# Altium project Softcore_SA_HW.PrjPcb
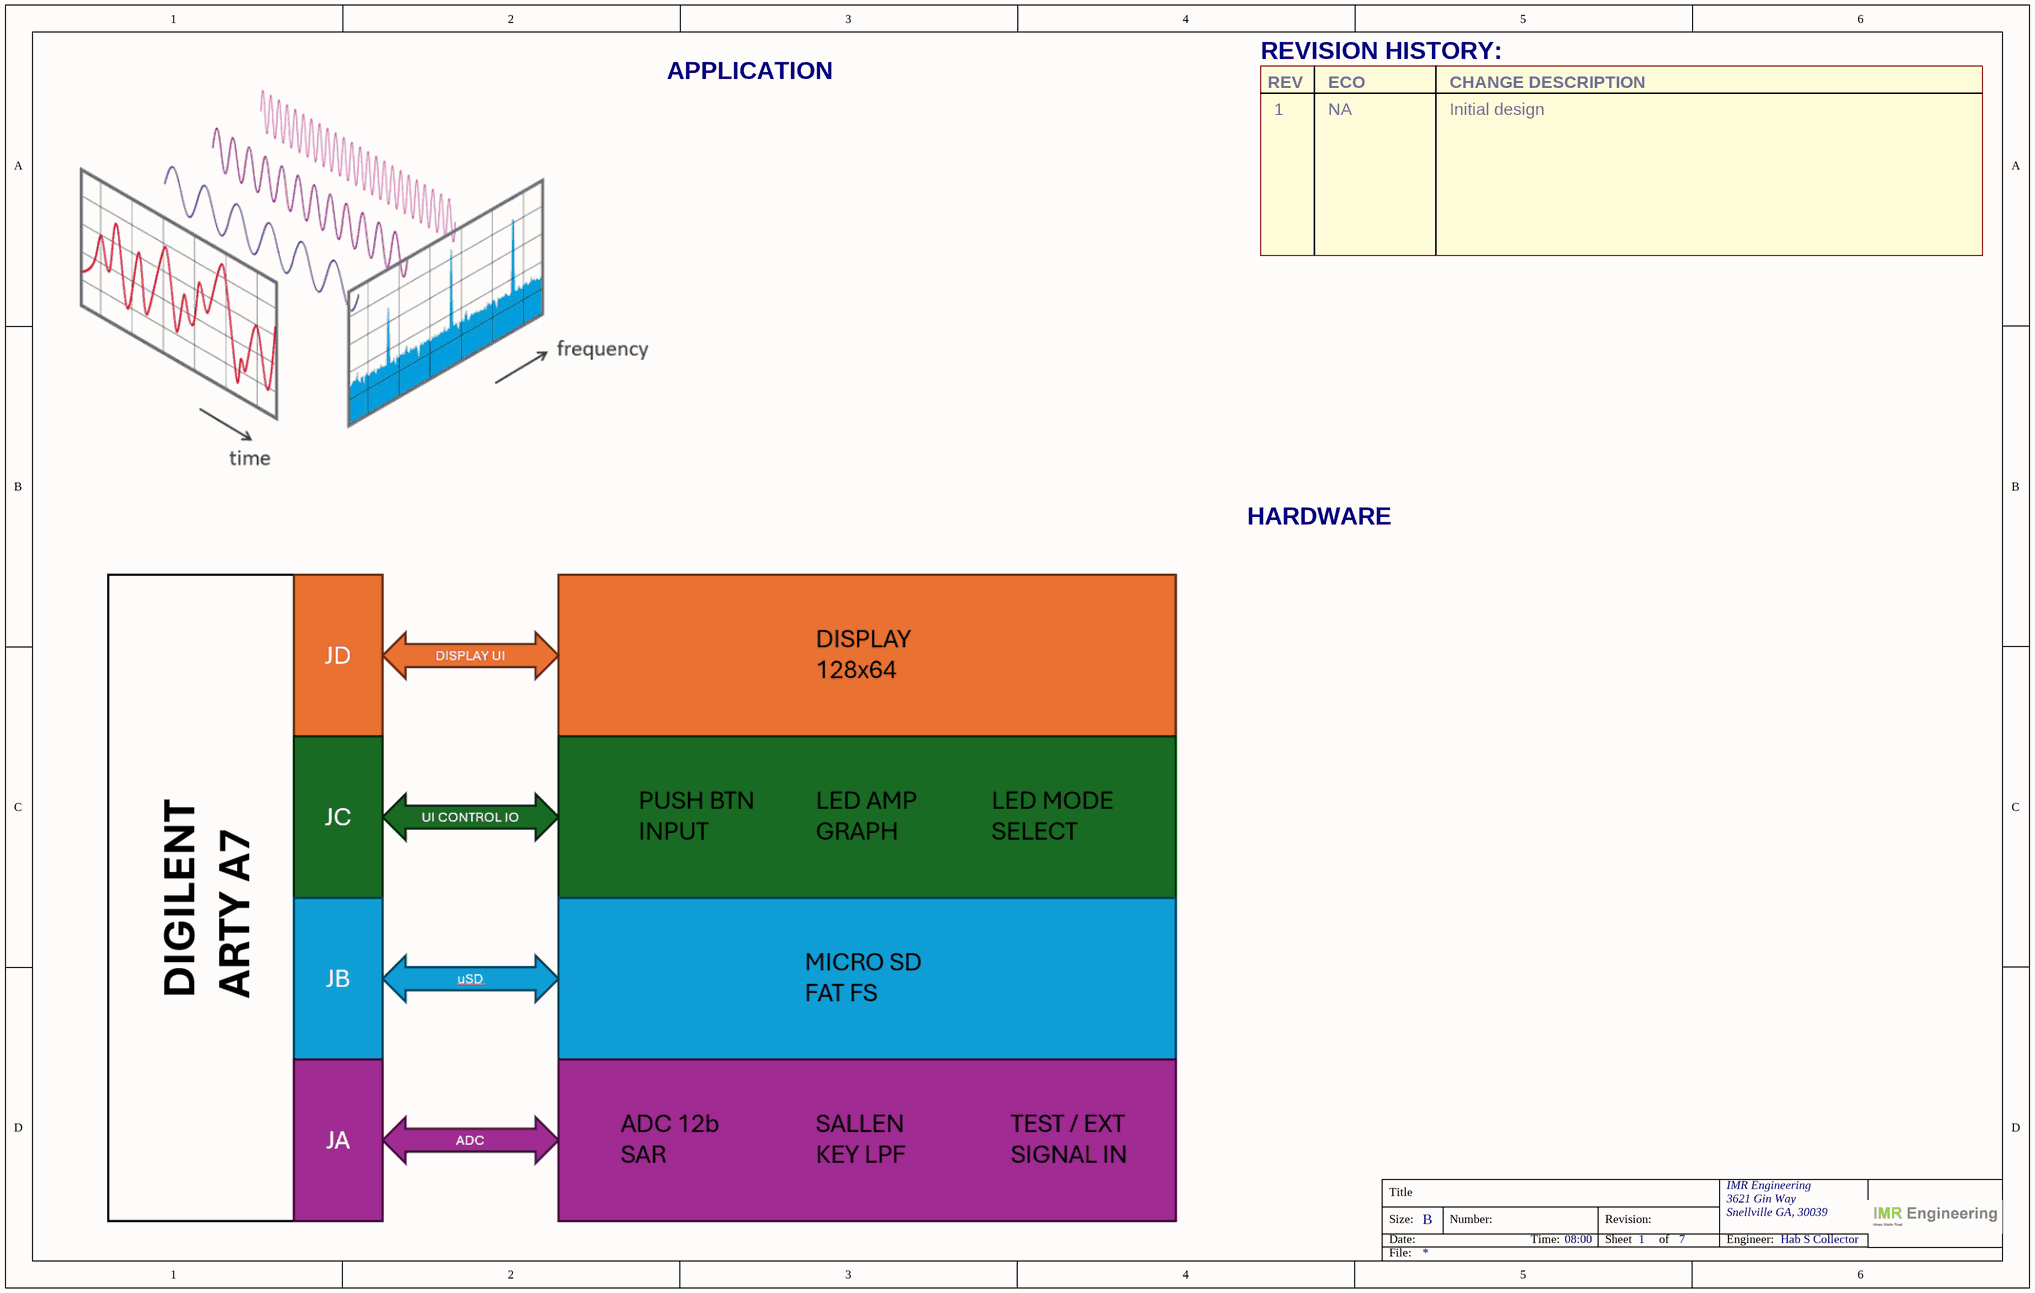
[diagram p0: SoftCore_SA_P1.SchDoc]
ProjectTitle: SoftCore SA Adapter; ProjectTime: 08:00; ProjectRevision: 1; ProjectDocumentNumber: IMR-006-SCH; ProjectDate: 02/26/26
7 sheets, 205 parts. Net scope: flat (ports and power ports of the same name join across sheets).
Sheets:
  SoftCore_SA_P1.SchDoc
  SoftCore_SA_P2.SchDoc
  SoftCore_SA_P3.SchDoc
  SoftCore_SA_P4.SchDoc
  SoftCore_SA_P5.SchDoc
  SoftCore_SA_P6.SchDoc
  SoftCore_SA_P7.SchDoc

## Sheet SoftCore_SA_P1.SchDoc: =ProjectTitle
size B; Date: 02/26/26; Engineer: Hab S Collector; Address1: 3621 Gin Way; Address2: Snellville GA, 30039; DocumentNumber: IMR-006-SCH; Revision: 1; SheetNumber: 1; SheetTotal: 7

### Notes on the sheet
- APPLICATION
- REVISION HISTORY:
- REV
- ECO
- CHANGE DESCRIPTION
- 1
- NA
- Initial design
- HARDWARE
- Title
- Size:
- Date:
- B
- Number:
- Time:
- Revision:
- Sheet
- of
- IMR Engineering
- Engineer:
- File:

## Sheet SoftCore_SA_P2.SchDoc: =ProjectTitle
size B; Date: 02/26/26; Engineer: Hab S Collector; Address1: 3621 Gin Way; Address2: Snellville GA, 30039; DocumentNumber: IMR-006-SCH; Revision: 1; SheetNumber: 2; SheetTotal: 7
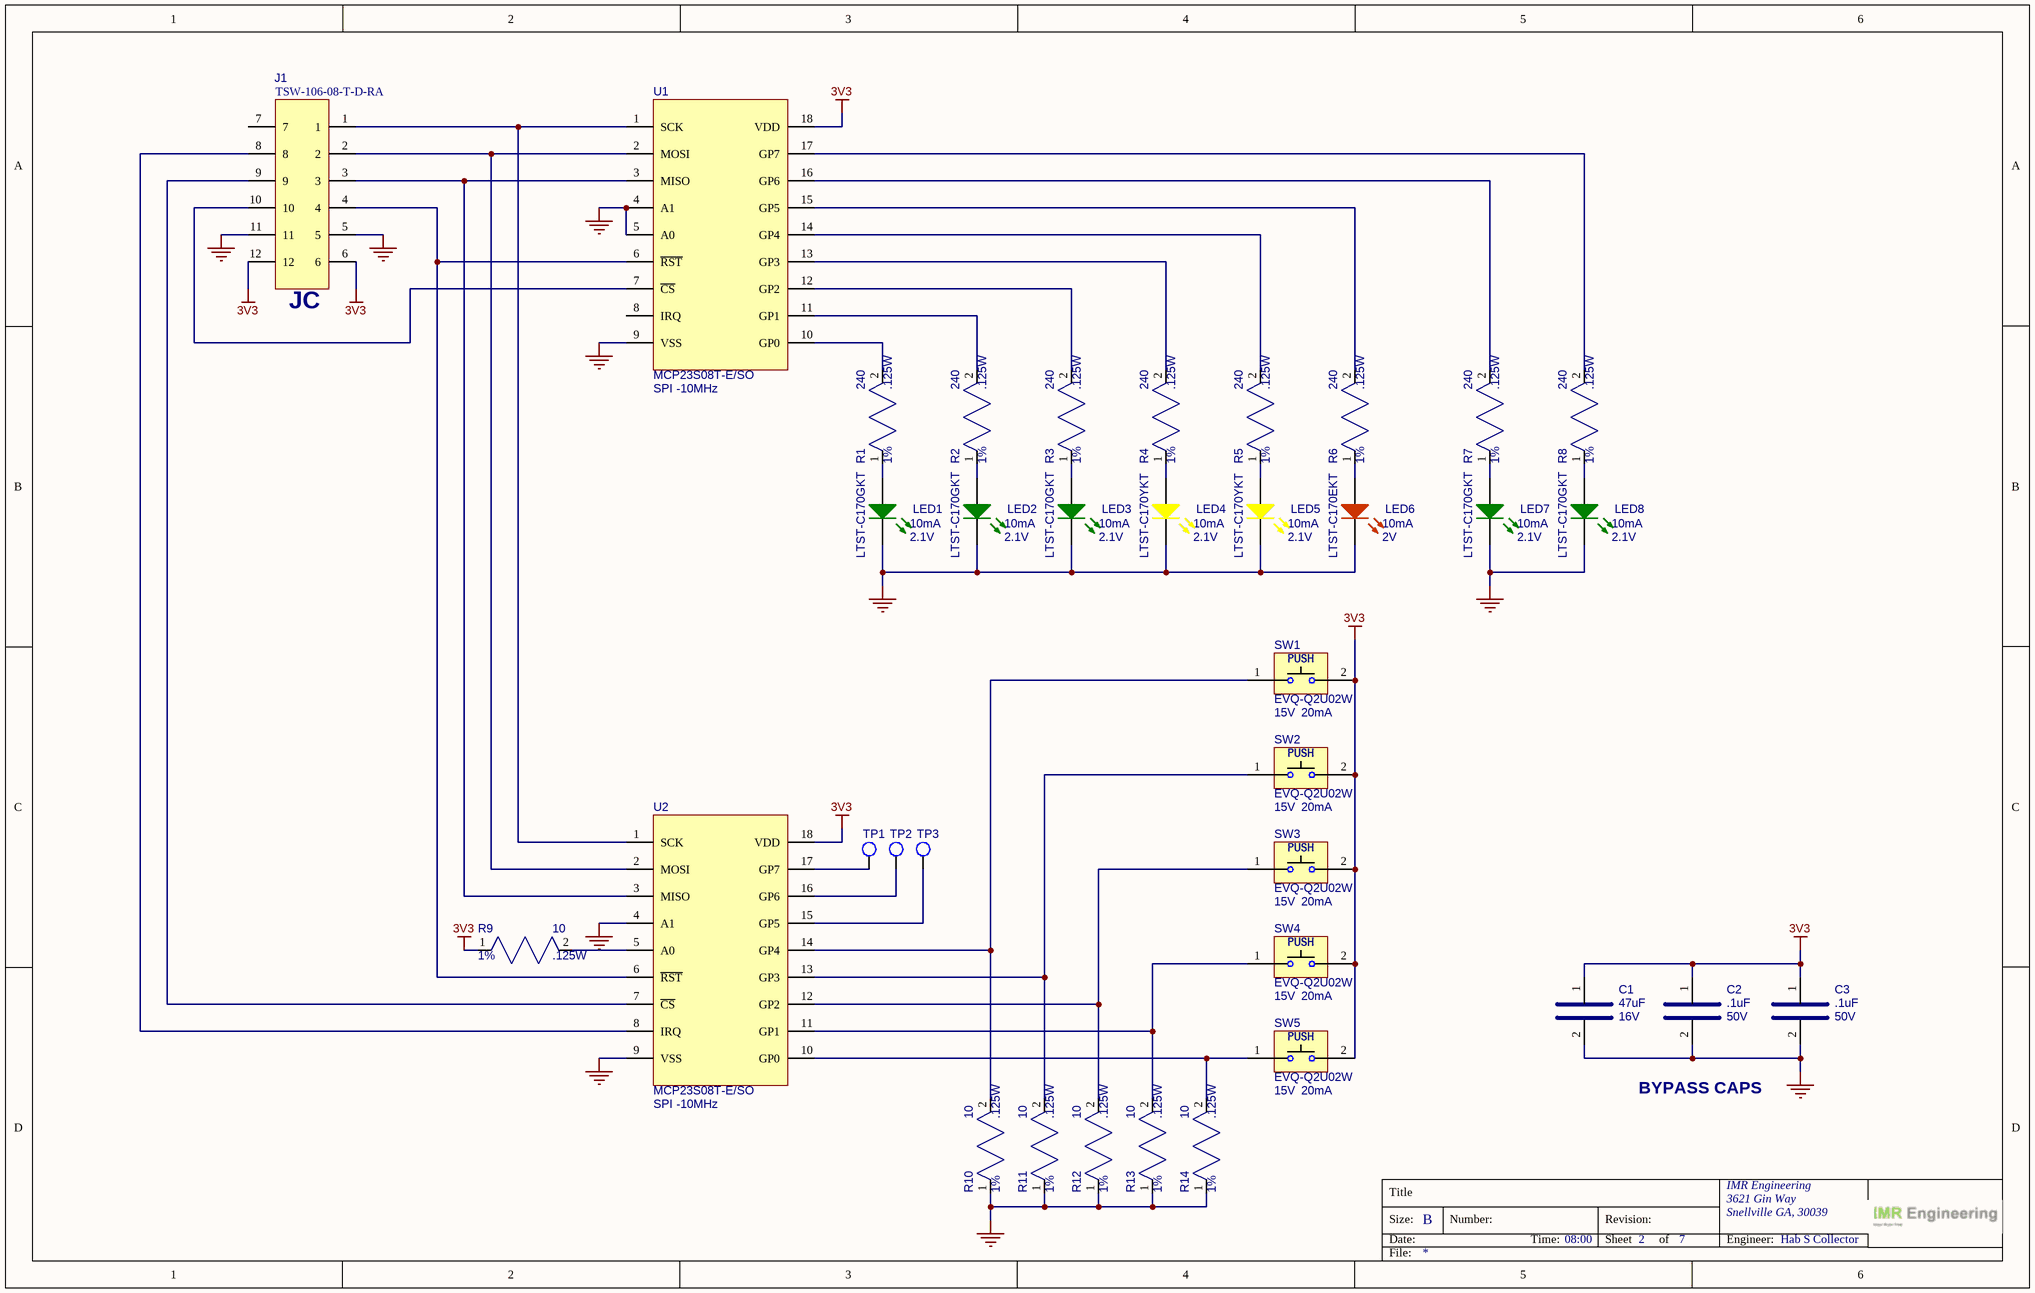
[diagram p1: SoftCore_SA_P2.SchDoc]

### Parts
C1  value 47uF  Voltage: 16V  [CAP_1210]  (hidden comment: GRM32ER60J476ME20L)
C2  value .1uF  Voltage: 50V  [CAP_0805]  (hidden comment: KGM21NR71H104KT)
C3  value .1uF  Voltage: 50V  [CAP_0805]  (hidden comment: KGM21NR71H104KT)
J1  TSW-106-08-T-D-RA  [SAMTEC_TSW-106-08-T-D-RA]
LED1  value 2.1V  Current: 10mA  [LED_0805]  (hidden comment: LTST-C170GKT)
LED2  value 2.1V  Current: 10mA  [LED_0805]  (hidden comment: LTST-C170GKT)
LED3  value 2.1V  Current: 10mA  [LED_0805]  (hidden comment: LTST-C170GKT)
LED4  value 2.1V  Current: 10mA  [LED_0805]  (hidden comment: LTST-C170YKT)
LED5  value 2.1V  Current: 10mA  [LED_0805]  (hidden comment: LTST-C170YKT)
LED6  value 2V  Current: 10mA  [LED_0805]  (hidden comment: LTST-C170EKT)
LED7  value 2.1V  Current: 10mA  [LED_0805]  (hidden comment: LTST-C170GKT)
LED8  value 2.1V  Current: 10mA  [LED_0805]  (hidden comment: LTST-C170GKT)
R1  value 240  Power: .125W  Tolerance: 1%  [RES_0805]  (hidden comment: RC0805FR-13240RL)
R2  value 240  Power: .125W  Tolerance: 1%  [RES_0805]  (hidden comment: RC0805FR-13240RL)
R3  value 240  Power: .125W  Tolerance: 1%  [RES_0805]  (hidden comment: RC0805FR-13240RL)
R4  value 240  Power: .125W  Tolerance: 1%  [RES_0805]  (hidden comment: RC0805FR-13240RL)
R5  value 240  Power: .125W  Tolerance: 1%  [RES_0805]  (hidden comment: RC0805FR-13240RL)
R6  value 240  Power: .125W  Tolerance: 1%  [RES_0805]  (hidden comment: RC0805FR-13240RL)
R7  value 240  Power: .125W  Tolerance: 1%  [RES_0805]  (hidden comment: RC0805FR-13240RL)
R8  value 240  Power: .125W  Tolerance: 1%  [RES_0805]  (hidden comment: RC0805FR-13240RL)
R9  value 10  Power: .125W  Tolerance: 1%  [RES_0805]  (hidden comment: RC0805FR-1310RL)
R10  value 10  Power: .125W  Tolerance: 1%  [RES_0805]  (hidden comment: RC0805FR-1310RL)
R11  value 10  Power: .125W  Tolerance: 1%  [RES_0805]  (hidden comment: RC0805FR-1310RL)
R12  value 10  Power: .125W  Tolerance: 1%  [RES_0805]  (hidden comment: RC0805FR-1310RL)
R13  value 10  Power: .125W  Tolerance: 1%  [RES_0805]  (hidden comment: RC0805FR-1310RL)
R14  value 10  Power: .125W  Tolerance: 1%  [RES_0805]  (hidden comment: RC0805FR-1310RL)
SW1  value 15V  Current: 20mA  [PANASONIC_EVQ-Q2U02W]  (hidden comment: EVQ-Q2U02W)
SW2  value 15V  Current: 20mA  [PANASONIC_EVQ-Q2U02W]  (hidden comment: EVQ-Q2U02W)
SW3  value 15V  Current: 20mA  [PANASONIC_EVQ-Q2U02W]  (hidden comment: EVQ-Q2U02W)
SW4  value 15V  Current: 20mA  [PANASONIC_EVQ-Q2U02W]  (hidden comment: EVQ-Q2U02W)
SW5  value 15V  Current: 20mA  [PANASONIC_EVQ-Q2U02W]  (hidden comment: EVQ-Q2U02W)
TP1  (no value)  [TEST_POINT_20MIL_TH]  (no BOM)
TP2  (no value)  [TEST_POINT_20MIL_TH]  (no BOM)
TP3  (no value)  [TEST_POINT_20MIL_TH]  (no BOM)
U1  value SPI -10MHz  [SOIC-18_300]  (hidden comment: MCP23S08T-E/SO)
U2  value SPI -10MHz  [SOIC-18_300]  (hidden comment: MCP23S08T-E/SO)

### Nets
3V3: C1.1 C2.1 C3.1 J1.6 J1.12 R9.1 SW1.2(B') SW2.2(B') SW3.2(B') SW4.2(B') SW5.2(B') U1.18(VDD) U2.18(VDD)
GND: C1.2 C2.2 C3.2 J1.5 J1.11 LED1.K LED2.K LED3.K LED4.K LED5.K LED6.K LED7.K LED8.K R10.1 R11.1 R12.1 R13.1 R14.1 U1.4(A1) U1.5(A0) U1.9(VSS) U2.4(A1) U2.9(VSS)
NetJ1_1: J1.1 U1.1(SCK) U2.1(SCK)
NetJ1_2: J1.2 U1.2(MOSI) U2.2(MOSI)
NetJ1_3: J1.3 U1.3(MISO) U2.3(MISO)
NetJ1_4: J1.4 U1.6(~{RST}) U2.6(~{RST})
NetJ1_8: J1.8 U2.8(IRQ)
NetJ1_9: J1.9 U2.7(~{CS})
NetJ1_10: J1.10 U1.7(~{CS})
NetLED1_A: LED1.A R1.1
NetLED2_A: LED2.A R2.1
NetLED3_A: LED3.A R3.1
NetLED4_A: LED4.A R4.1
NetLED5_A: LED5.A R5.1
NetLED6_A: LED6.A R6.1
NetLED7_A: LED7.A R7.1
NetLED8_A: LED8.A R8.1
NetR1_2: R1.2 U1.10(GP0)
NetR2_2: R2.2 U1.11(GP1)
NetR3_2: R3.2 U1.12(GP2)
NetR4_2: R4.2 U1.13(GP3)
NetR5_2: R5.2 U1.14(GP4)
NetR6_2: R6.2 U1.15(GP5)
NetR7_2: R7.2 U1.16(GP6)
NetR8_2: R8.2 U1.17(GP7)
NetR9_2: R9.2 U2.5(A0)
NetR10_2: R10.2 SW1.1(B) U2.14(GP4)
NetR11_2: R11.2 SW2.1(B) U2.13(GP3)
NetR12_2: R12.2 SW3.1(B) U2.12(GP2)
NetR13_2: R13.2 SW4.1(B) U2.11(GP1)
NetR14_2: R14.2 SW5.1(B) U2.10(GP0)
NetTP1_1: TP1.1 U2.17(GP7)
NetTP2_1: TP2.1 U2.16(GP6)
NetTP3_1: TP3.1 U2.15(GP5)

Not connected (* = marked no-connect by the designer): J1 7; U1 8(IRQ)

### Notes on the sheet
- (near J1) JC
- BYPASS CAPS
- Title
- Size:
- Date:
- B
- Number:
- Time:
- Revision:
- Sheet
- of
- IMR Engineering
- Engineer:
- File:
- (in symbol SWITCH_EVQ-Q2U02W) PUSH

### Library data of the parts
C1 = CAP_SMD_47UF_16V_1210: CAP CER 47UF 50V X5R 1210; MFG: Murata Electronics; Case/Package: 1210; MFG_PN: GRM32ER60J476ME20L; Supplier 1: DigiKey; Supplier Part Number 1: 490-1887-1-ND; Unit Price: .28
C2 C3 = CAP_SMD_0.1UF_50V_0805: CAP CER 0.1UF 50V X7R 0805; MFG: KYOCERA AVX; Case/Package: 0805; MFG_PN: KGM21NR71H104KT; Supplier 1: DigiKey; Supplier Part Number 1: 478-KGM21NR71H104KTCT-ND; Unit Price: .1
J1 = CONN_HEADER_12P_100MIL_RA: CONN HEADER R/A 12POS 2.54MM; MFG: Samtec Inc.; Case/Package: 2P_2.54MM; Supplier 1: Digi-Key; Supplier Part Number 1: SAM1049-06-ND; Unit Price: .93; MFG_PN: TSW-106-08-T-D-RA
LED1-LED3 LED7 LED8 = LED_GREEN_LTST-C170GKT: LED GREEN CLEAR SMD; MFG: Lite-On; Case/Package: 0805; Supplier 1: DigiKey; Supplier Part Number 1: 160-1179-1-ND; Unit Price: .10; MFG_PN: LTST-C170GKT
LED4 LED5 = LED_YELLOW_LTST-C170YKT: LED YELLOW CLEAR SMD; MFG: Lite-On; Case/Package: 0805; Supplier 1: DigiKey; Supplier Part Number 1: 160-1175-1-ND; Unit Price: .15; MFG_PN: LTST-C170YKT
LED6 = LED_RED_LTST-C170EKT: LED RED CLEAR SMD; MFG: Lite-On; Case/Package: 0805; Supplier 1: DigiKey; Supplier Part Number 1: 160-1178-1-ND; Unit Price: .18; MFG_PN: LTST-C170EKT
R1-R8 = RES_SMD_240_0805_1/8W_1%: RES SMD 240 OHM 1% 1/8W 0805; MFG: Yageo; Case/Package: 0805; MFG_PN: RC0805FR-13240RL; Supplier 1: DigiKey; Supplier Part Number 1: 13-RC0805FR-13240RLCT-ND; Unit Price: .1
R9-R14 = RES_SMD_10_0805_1/8W_1%: RES SMD 10 OHM 1% 1/8W 0805; MFG: Yageo; Case/Package: 0805; MFG_PN: RC0805FR-1310RL; Supplier 1: DigiKey; Supplier Part Number 1: 13-RC0805FR-1310RLCT-ND; Unit Price: .1
SW1-SW5 = SWITCH_EVQ-Q2U02W: SWITCH TACTILE SPST-NO 0.02A 15V; MFG: American Zettler; Case/Package: EVQQ2; Supplier 1: DigiKey; Supplier Part Number 1: P12954SCT-ND; Unit Price: .25; MFG_PN: EVQ-Q2U02W
TP1-TP3 = CONN_TEST_POINT_TH_PAD_20MIL: TEST POINT TH 20MIL HOLE
U1 U2 = IC_MCP23S08T-E/SO: IC IO XPNDR 10MHZ SPI 18SOIC; MFG: Microchip; Case/Package: SOIC-18-300; Supplier 1: DigiKey; Supplier Part Number 1: MCP23S08T-E/SOCT-ND; Unit Price: 1.54; MFG_PN: MCP23S08T-E/SO

## Sheet SoftCore_SA_P3.SchDoc: =ProjectTitle
size B; Date: 02/26/26; Engineer: Hab S Collector; Address1: 3621 Gin Way; Address2: Snellville GA, 30039; DocumentNumber: IMR-006-SCH; Revision: 1; SheetNumber: 3; SheetTotal: 7
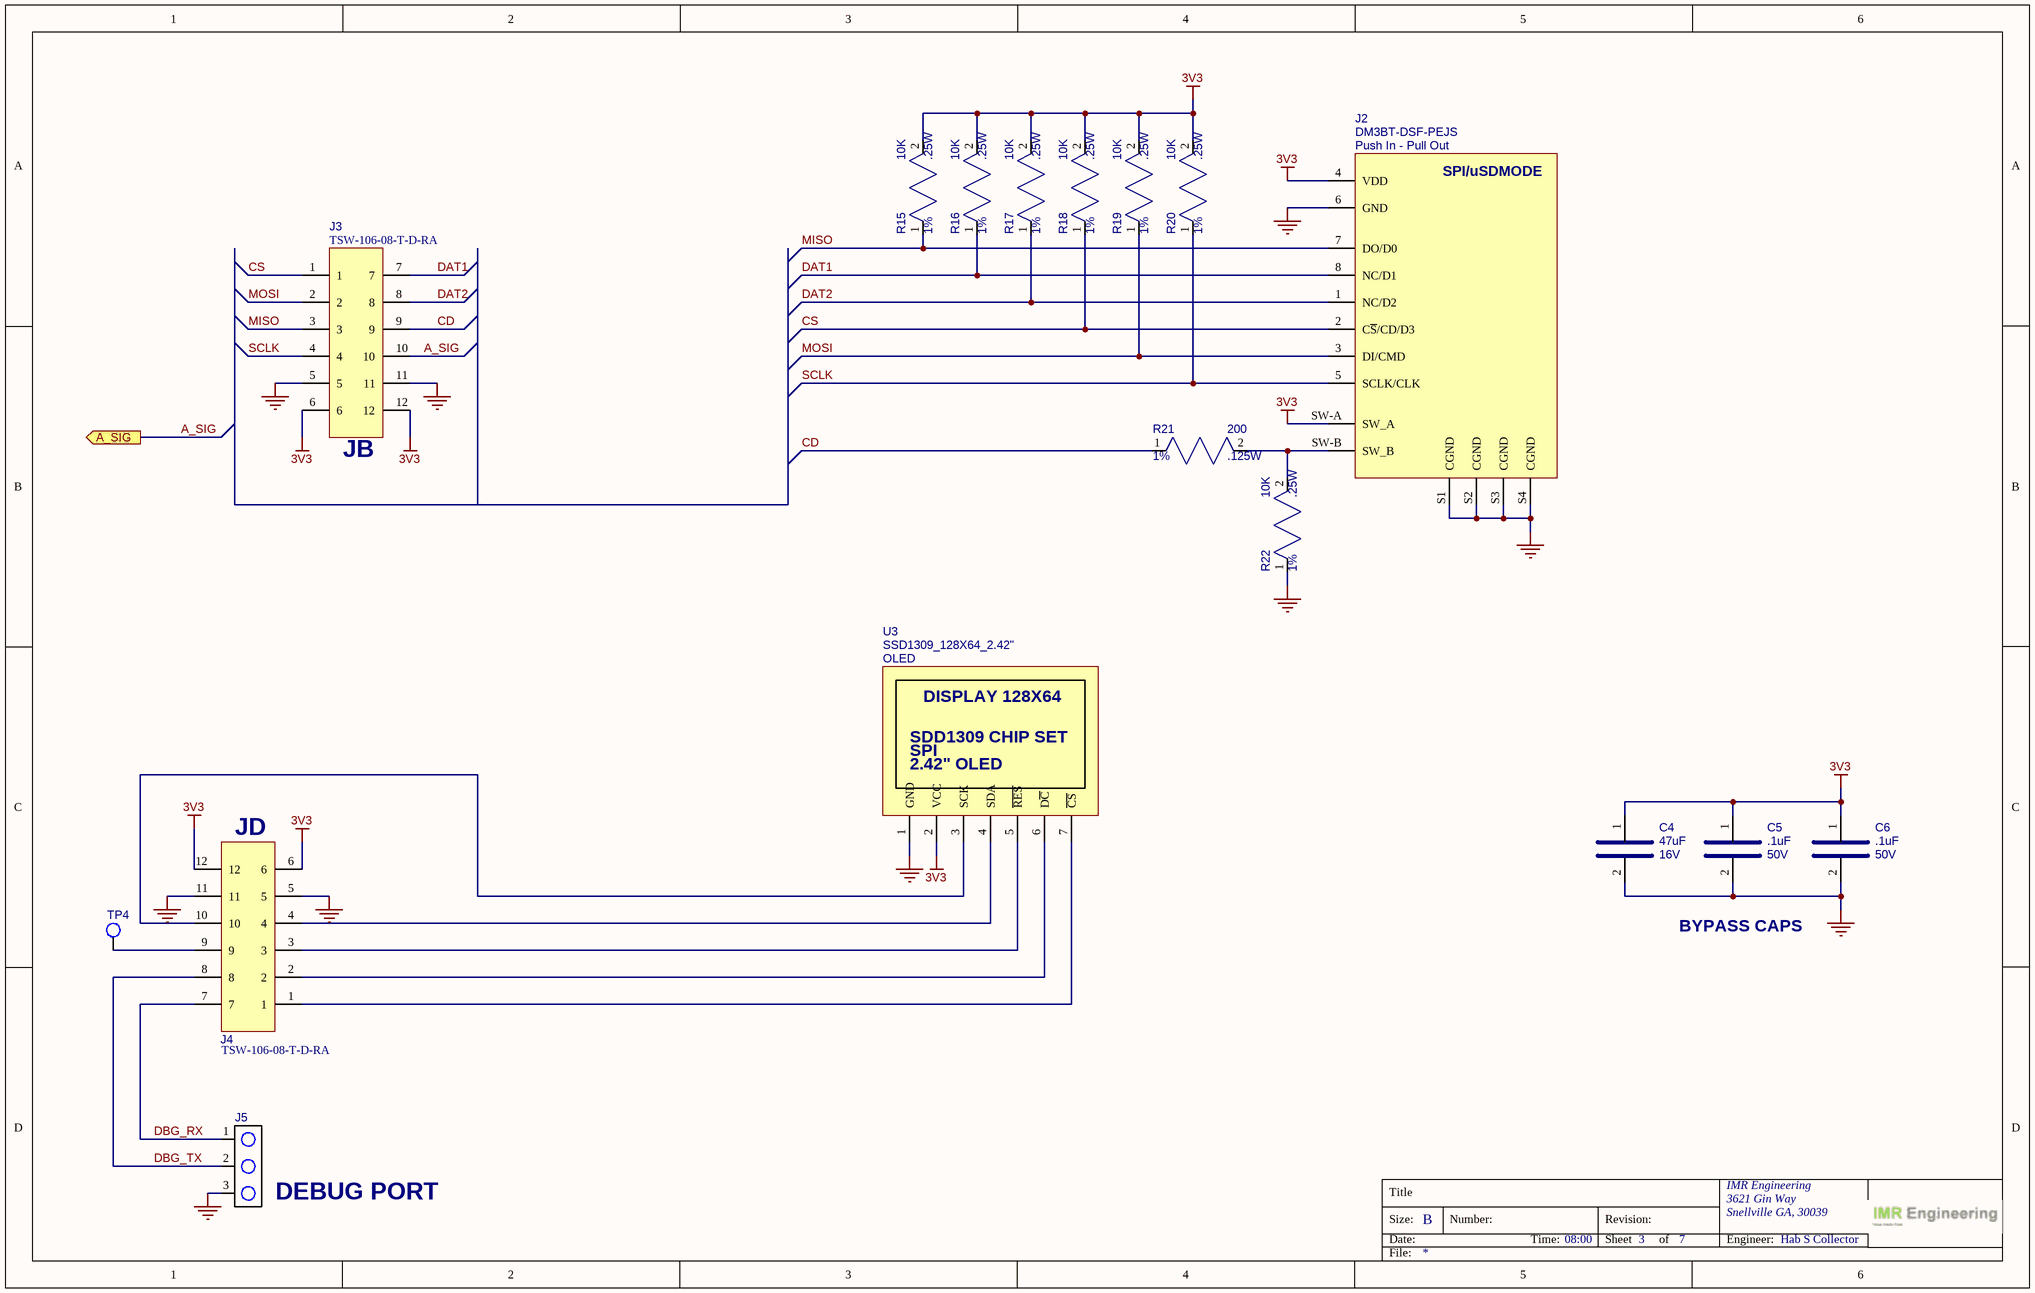
[diagram p2: SoftCore_SA_P3.SchDoc]

### Parts
C4  value 47uF  Voltage: 16V  [CAP_1210]  (hidden comment: GRM32ER60J476ME20L)
C5  value .1uF  Voltage: 50V  [CAP_0805]  (hidden comment: KGM21NR71H104KT)
C6  value .1uF  Voltage: 50V  [CAP_0805]  (hidden comment: KGM21NR71H104KT)
J2  value Push In - Pull Out  [HRS_DM3BT-DSF-PEJS]  (hidden comment: DM3BT-DSF-PEJS)
J3  TSW-106-08-T-D-RA  [SAMTEC_TSW-106-08-T-D-RA]
J4  TSW-106-08-T-D-RA  [SAMTEC_TSW-106-08-T-D-RA]
J5  PREC003SFAN-RC  [HDR_1X3_100MILL]  (value not drawn)
R15  value 10K  Power: .25W  Tolerance: 1%  [RES_0805]  (hidden comment: RC0805FR-7W10KL)
R16  value 10K  Power: .25W  Tolerance: 1%  [RES_0805]  (hidden comment: RC0805FR-7W10KL)
R17  value 10K  Power: .25W  Tolerance: 1%  [RES_0805]  (hidden comment: RC0805FR-7W10KL)
R18  value 10K  Power: .25W  Tolerance: 1%  [RES_0805]  (hidden comment: RC0805FR-7W10KL)
R19  value 10K  Power: .25W  Tolerance: 1%  [RES_0805]  (hidden comment: RC0805FR-7W10KL)
R20  value 10K  Power: .25W  Tolerance: 1%  [RES_0805]  (hidden comment: RC0805FR-7W10KL)
R21  value 200  Power: .125W  Tolerance: 1%  [RES_0805]  (hidden comment: RC0805FR-07200RL)
R22  value 10K  Power: .25W  Tolerance: 1%  [RES_0805]  (hidden comment: RC0805FR-7W10KL)
TP4  (no value)  [TEST_POINT_20MIL_TH]  (no BOM)
U3  TYPE: OLED  [MODULE_DISPLAY_128X64_2.42]  (hidden comment: SSD1309_128X64_2.42")

### Ports
A_SIG (out)

### Nets
3V3: C4.1 C5.1 C6.1 J2.4(VDD) J2.SW-A(SW_A) J3.6 J3.12 J4.6 J4.12 R15.2 R16.2 R17.2 R18.2 R19.2 R20.2 U3.2(VCC)
GND: C4.2 C5.2 C6.2 J2.6(GND) J2.S1(CGND) J2.S2(CGND) J2.S3(CGND) J2.S4(CGND) J3.5 J3.11 J4.5 J4.11 J5.3 R22.1 U3.1(GND)
A_SIG: J3.10 ; port A_SIG
CD: J3.9 R21.1
CS: J2.2(C~{S}/CD/D3) J3.1 R18.1
DAT1: J2.8(NC/D1) J3.7 R16.1
DAT2: J2.1(NC/D2) J3.8 R17.1
DBG_RX: J4.7 J5.1
DBG_TX: J4.8 J5.2
MISO: J2.7(DO/D0) J3.3 R15.1
MOSI: J2.3(DI/CMD) J3.2 R19.1
SCLK: J2.5(SCLK/CLK) J3.4 R20.1
NetJ2_SW-B: J2.SW-B(SW_B) R21.2 R22.2
NetJ4_1: J4.1 U3.7(~{CS})
NetJ4_2: J4.2 U3.6(D~{C})
NetJ4_3: J4.3 U3.5(~{RES})
NetJ4_4: J4.4 U3.4(SDA)
NetJ4_9: J4.9 TP4.1
NetJ4_10: J4.10 U3.3(SCK)

### Notes on the sheet
- (near J3) JB
- (near J4) JD
- BYPASS CAPS
- (near J5) DEBUG PORT
- Title
- Size:
- Date:
- B
- Number:
- Time:
- Revision:
- Sheet
- of
- IMR Engineering
- Engineer:
- File:
- (in symbol CONN_MICRO-SD_DM3BT-DSF-PEJS) SPI/uSDMODE
- (in symbol MODULE_DISPLAY_128X64_2.42) DISPLAY 128X64; SDD1309 CHIP SET; SPI; 2.42" OLED

### Library data of the parts
C4 = CAP_SMD_47UF_16V_1210: as C1 on sheet SoftCore_SA_P2; Case/Package: 1210; MFG_PN: GRM32ER60J476ME20L; Supplier 1: DigiKey; Supplier Part Number 1: 490-1887-1-ND; Unit Price: .28
C5 C6 = CAP_SMD_0.1UF_50V_0805: as C2 on sheet SoftCore_SA_P2; Case/Package: 0805; MFG_PN: KGM21NR71H104KT; Supplier 1: DigiKey; Supplier Part Number 1: 478-KGM21NR71H104KTCT-ND; Unit Price: .1
J2 = CONN_MICRO-SD_DM3BT-DSF-PEJS: CONN MICRO SD CARD R/A SMD; MFG: Hirose Electric Co Ltd; Case/Package: DM3BT-DSF-PEJS; Supplier 1: DigiKey; Supplier Part Number 1: HR1942CT-ND; Unit Price: 2.30; MFG_PN: DM3BT-DSF-PEJS
J3 J4 = CONN_HEADER_12P_100MIL_RA: as J1 on sheet SoftCore_SA_P2; Case/Package: 2P_2.54MM; Supplier 1: Digi-Key; Supplier Part Number 1: SAM1049-06-ND; Unit Price: .93; MFG_PN: TSW-106-08-T-D-RA
J5 = CONN_HEADER_3P_100MIL_VERT: CONN HEADER VERT 3POS 2.54MM; MFG: Sullins Connector Solutions; Case/Package: 2P_2.54MM; MFG_PN: PREC003SFAN-RC; Supplier 1: Digi-Key; Supplier Part Number 1: S1212EC-03-ND; Value: *; Unit Price: .07
R15-R20 R22 = RES_SMD_10K_0805_1/4W_1%: RES SMD 10K OHM 1% 1/4W 0805; MFG: Yageo; Case/Package: 0805; MFG_PN: RC0805FR-7W10KL; Supplier 1: DigiKey; Supplier Part Number 1: 13-RC0805FR-7W10KLCT-ND; Unit Price: .10
R21 = RES_SMD_200_0805_1/8W_1%: RES SMD 200 OHM 1% 1/8W 0805; MFG: Yageo; Case/Package: 0805; MFG_PN: RC0805FR-07200RL; Supplier 1: DigiKey; Supplier Part Number 1: 311-200CRCT-ND; Unit Price: .1
TP4 = CONN_TEST_POINT_TH_PAD_20MIL: TEST POINT TH 20MIL HOLE
U3 = MODULE_DISPLAY_128X64_2.42: DISPLAY 128X64 SSD1309 2.42" OLED WHITE; MFG: UNKNOWN; NOTES: This display is sold by several companies on Amazon - you can identify it by description and the back of the PCB - sellers: HiLetgo, Aceirmc; Case/Package: MODULE_DISPLAY_128X64_2.42; Supplier 1: Amazon; Supplier Part Number 1: SSD1309 2.42"; Unit Price: 16.99; Resolution: 128X64; MFG_PN: SSD1309_128X64_2.42"

## Sheet SoftCore_SA_P4.SchDoc: =ProjectTitle
size B; Date: 02/26/26; Engineer: Hab S Collector; Address1: 3621 Gin Way; Address2: Snellville GA, 30039; DocumentNumber: IMR-006-SCH; Revision: 1; SheetNumber: 4; SheetTotal: 7
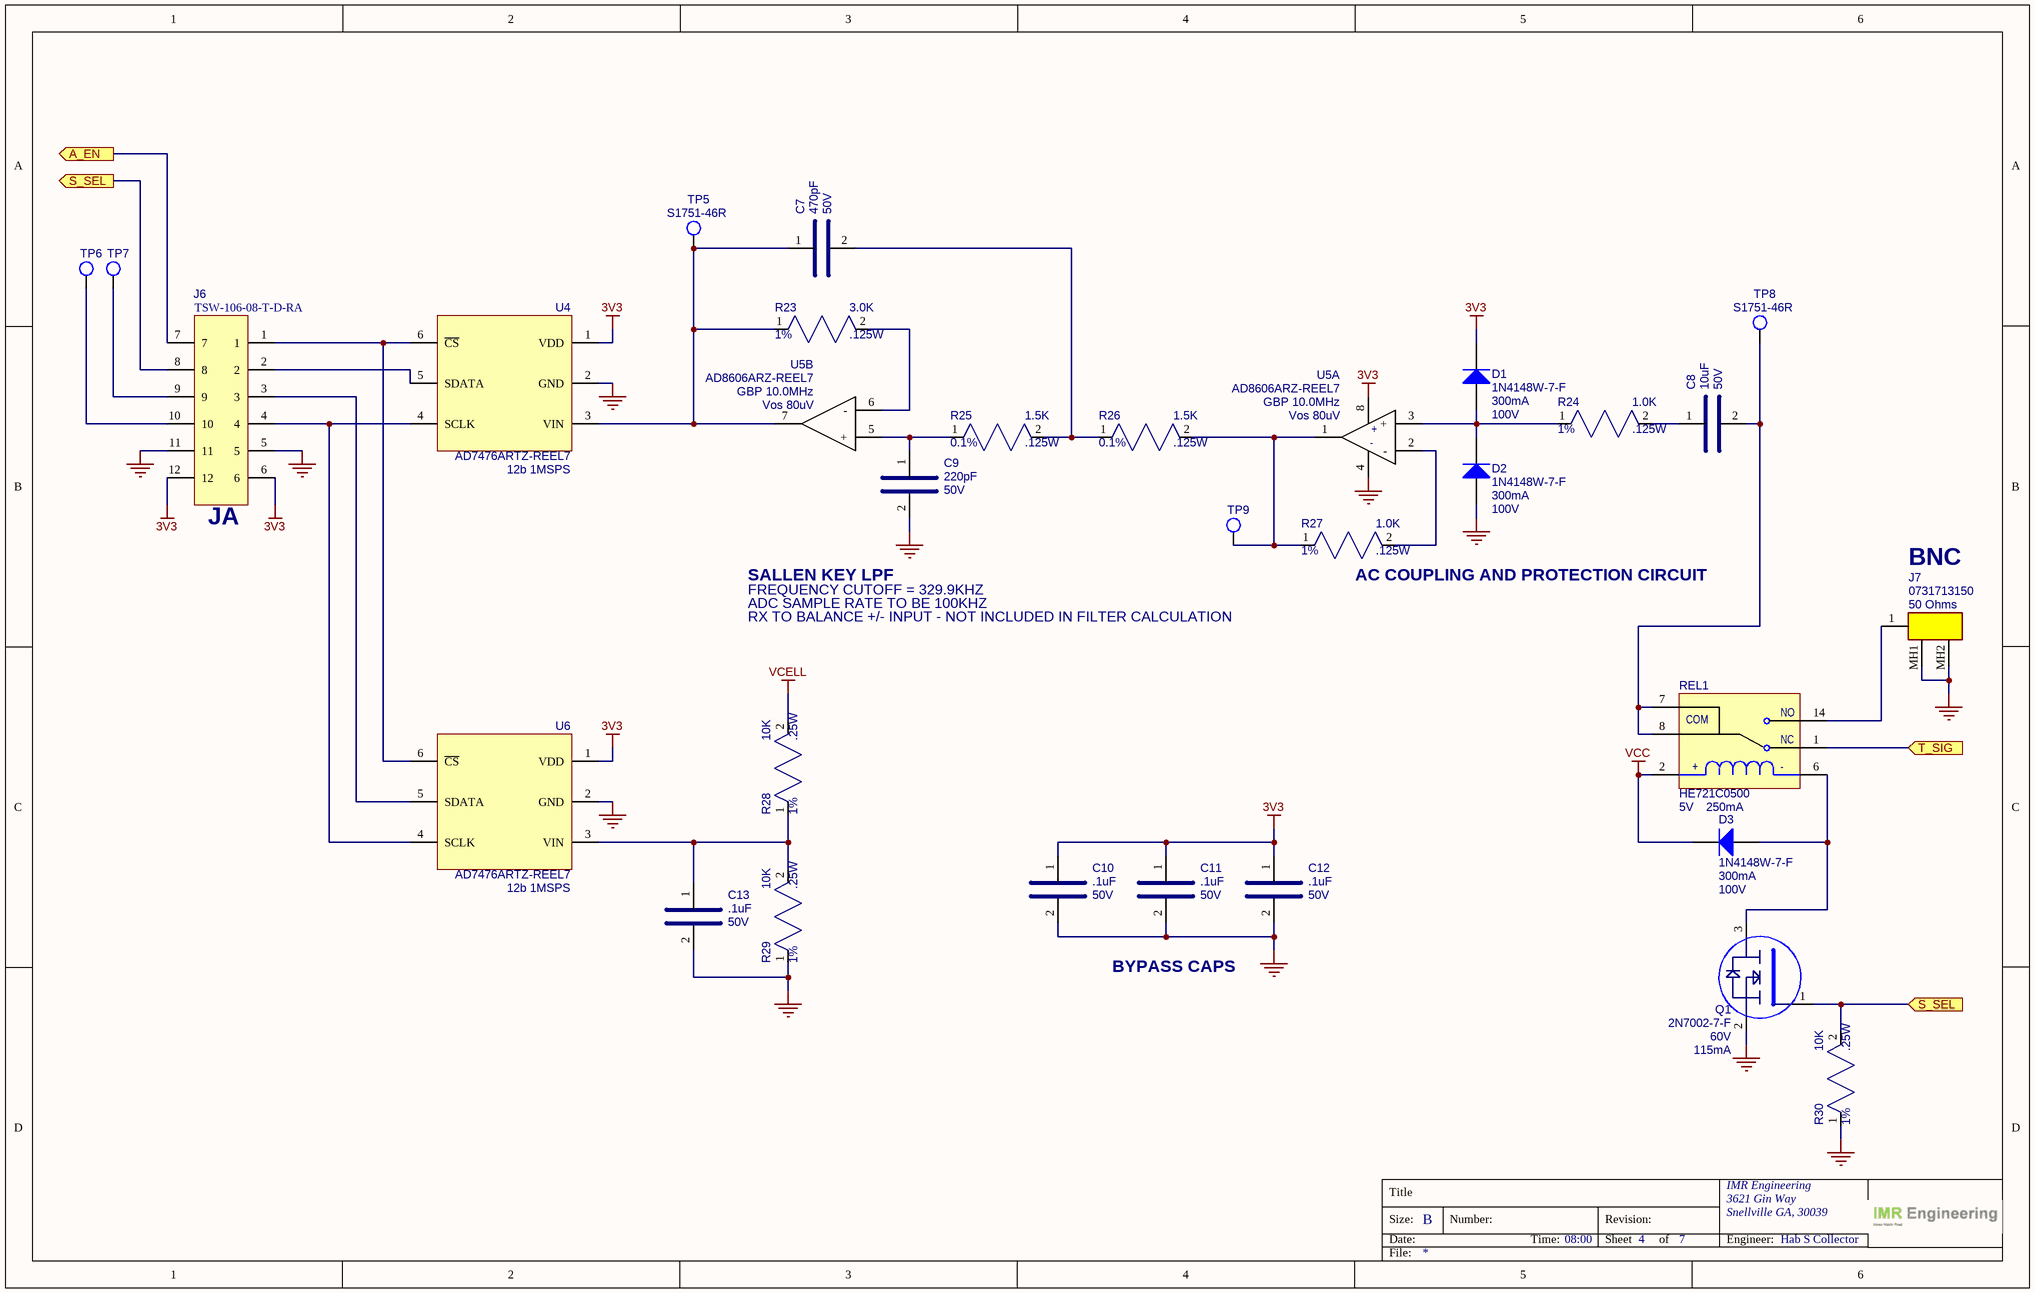
[diagram p3: SoftCore_SA_P4.SchDoc]

### Parts
C7  value 470pF  Voltage: 50V  [CAP_0805]  (hidden comment: CC0805JRNPO9BN471)
C8  value 10uF  Voltage: 50V  [CAP_0805]  (hidden comment: GRM21BR61H106KE43L)
C9  value 220pF  Voltage: 50V  [CAP_0805]  (hidden comment: CC0805JRNPO9BN221)
C10  value .1uF  Voltage: 50V  [CAP_0805]  (hidden comment: KGM21NR71H104KT)
C11  value .1uF  Voltage: 50V  [CAP_0805]  (hidden comment: KGM21NR71H104KT)
C12  value .1uF  Voltage: 50V  [CAP_0805]  (hidden comment: KGM21NR71H104KT)
C13  value .1uF  Voltage: 50V  [CAP_0805]  (hidden comment: KGM21NR71H104KT)
D1  value 100V  Current: 300mA  [SOD123]  (hidden comment: 1N4148W-7-F)
D2  value 100V  Current: 300mA  [SOD123]  (hidden comment: 1N4148W-7-F)
D3  value 100V  Current: 300mA  [SOD123]  (hidden comment: 1N4148W-7-F)
J6  TSW-106-08-T-D-RA  [SAMTEC_TSW-106-08-T-D-RA]
J7  value 50 Ohms  [731713150]  (hidden comment: 0731713150)
Q1  value 60V  Current: 115mA  [SOT-23]  (hidden comment: 2N7002-7-F)
R23  value 3.0K  Power: .125W  Tolerance: 1%  [RES_0805]  (hidden comment: RC0805FR-133KL)
R24  value 1.0K  Power: .125W  Tolerance: 1%  [RES_0805]  (hidden comment: RC0805FR-071KL)
R25  value 1.5K  Power: .125W  Tolerance: 0.1%  [RES_0805]  (hidden comment: RT0805BRD071K5L)
R26  value 1.5K  Power: .125W  Tolerance: 0.1%  [RES_0805]  (hidden comment: RT0805BRD071K5L)
R27  value 1.0K  Power: .125W  Tolerance: 1%  [RES_0805]  (hidden comment: RC0805FR-071KL)
R28  value 10K  Power: .25W  Tolerance: 1%  [RES_0805]  (hidden comment: RC0805FR-7W10KL)
R29  value 10K  Power: .25W  Tolerance: 1%  [RES_0805]  (hidden comment: RC0805FR-7W10KL)
R30  value 10K  Power: .25W  Tolerance: 1%  [RES_0805]  (hidden comment: RC0805FR-7W10KL)
REL1  value 5V  Current: 250mA  [HE700]  (hidden comment: HE721C0500)
TP5  S1751-46R  [HARWIN_S1751]
TP6  (no value)  [TEST_POINT_20MIL_TH]  (no BOM)
TP7  (no value)  [TEST_POINT_20MIL_TH]  (no BOM)
TP8  S1751-46R  [HARWIN_S1751]
TP9  (no value)  [TEST_POINT_20MIL_TH]  (no BOM)
U4  value 12b 1MSPS  [SOT-23-6]  (hidden comment: AD7476ARTZ-REEL7)
U5  value GBP 10.0MHz  Vos: Vos 80uV  [SOIC-8_54]  (hidden comment: AD8606ARZ-REEL7)  (parts A,B of 2)
U6  value 12b 1MSPS  [SOT-23-6]  (hidden comment: AD7476ARTZ-REEL7)

### Ports
A_EN (out), S_SEL (in), S_SEL (out), T_SIG (in)

### Nets
3V3: C10.1 C11.1 C12.1 D1.2(K) J6.6 J6.12 U4.1(VDD) U5.8 U6.1(VDD)
GND: C9.2 C10.2 C11.2 C12.2 C13.2 D2.1(A) J6.5 J6.11 J7.MH1 J7.MH2 Q1.2(E) R29.1 R30.1 U4.2(GND) U5.4 U6.2(GND)
VCC: D3.2(K) REL1.2
VCELL: R28.2
NetC7_1: C7.1 R23.1 TP5.1 U4.3(VIN) U5.7
NetC7_2: C7.2 R25.2 R26.1
NetC8_1: C8.1 R24.2
NetC8_2: C8.2 REL1.7(COM) REL1.8(COM) TP8.1
NetC9_1: C9.1 R25.1 U5.5(+)
NetC13_1: C13.1 R28.1 R29.2 U6.3(VIN)
NetC14_2: REL1.1(NC) ; port T_SIG
NetD1_1: D1.1(A) D2.2(K) R24.1 U5.3(+)
NetD3_1: D3.1(A) Q1.3(C) REL1.6
NetJ6_1: J6.1 U4.6(~{CS}) U6.6(~{CS})
NetJ6_2: J6.2 U4.5(SDATA)
NetJ6_3: J6.3 U6.5(SDATA)
NetJ6_4: J6.4 U4.4(SCLK) U6.4(SCLK)
NetJ6_7: J6.7 ; port A_EN
NetJ6_8: J6.8 Q1.1(B) R30.2 ; port S_SEL
NetJ6_9: J6.9 TP7.1
NetJ6_10: J6.10 TP6.1
NetJ7_1: J7.1 REL1.14(NO)
NetR23_2: R23.2 U5.6(-)
NetR26_2: R26.2 R27.1 TP9.1 U5.1
NetR27_2: R27.2 U5.2(-)

### Notes on the sheet
- (near J6) JA
- BNC
- SALLEN KEY LPF
- FREQUENCY CUTOFF = 329.9KHZ
- ADC SAMPLE RATE TO BE 100KHZ
- RX TO BALANCE +/- INPUT - NOT INCLUDED IN FILTER CALCULATION
- (near R27) AC COUPLING AND PROTECTION CIRCUIT
- BYPASS CAPS
- Title
- Size:
- Date:
- B
- Number:
- Time:
- Revision:
- Sheet
- of
- IMR Engineering
- Engineer:
- File:
- (in symbol RELAY_HE721C0500) +; -

### Library data of the parts
C7 = CAP_SMD_470PF_50V_0805: CAP CER 470PF 50V COG/NP0 0805; MFG: Yageo; Type: COG, NP0; Tolerance: 5%; Case/Package: 0805; MFG_PN: CC0805JRNPO9BN471; Supplier 1: DigiKey; Supplier Part Number 1: 311-1119-1-ND; Unit Price: .11
C8 = CAP_SMD_10UF_50V_0805: CAP CER 10UF 50V X5R 0805; MFG: Murata Electronics; Case/Package: 0805; MFG_PN: GRM21BR61H106KE43L; Supplier 1: DigiKey; Supplier Part Number 1: 490-18663-1-ND; Unit Price: .28
C9 = CAP_SMD_220PF_50V_0805: CAP CER 220PF 50V COG/NP0 0805; MFG: Yageo; Type: COG, NP0; Tolerance: 5%; Case/Package: 0805; MFG_PN: CC0805JRNPO9BN221; Supplier 1: DigiKey; Supplier Part Number 1: 311-1115-1-ND; Unit Price: .11
C10-C13 = CAP_SMD_0.1UF_50V_0805: as C2 on sheet SoftCore_SA_P2; Case/Package: 0805; MFG_PN: KGM21NR71H104KT; Supplier 1: DigiKey; Supplier Part Number 1: 478-KGM21NR71H104KTCT-ND; Unit Price: .1
D1-D3 = DIODE_1N4148W-7-F: RELAY REED SPDT 250MA 5V; MFG: Diodes Inc; Case/Package: SOD-123; Supplier 1: DigiKey; Supplier Part Number 1: 1N4148W-FDICT-ND; Unit Price: .16; MFG_PN: 1N4148W-7-F
J6 = CONN_HEADER_12P_100MIL_RA: as J1 on sheet SoftCore_SA_P2; Case/Package: 2P_2.54MM; Supplier 1: Digi-Key; Supplier Part Number 1: SAM1049-06-ND; Unit Price: .93; MFG_PN: TSW-106-08-T-D-RA
J7 = CONN_MOLEX_0731713150: CONN BNC RCPT R/A 50 OHM PCB; MFG: Molex; Case/Package: 73099-2; Supplier 1: DigiKey; Supplier Part Number 1: WM20430-ND; Unit Price: 1.40; MFG_PN: 0731713150
Q1 = MOSFET_NCH_2N7002-7-F: MOSFET N-CH 60V 115MA SOT23-3; MFG: Diodes Inc; Case/Package: SOT-23; Supplier 1: DigiKey; Supplier Part Number 1: 2N7002-FDICT-ND; Unit Price: .20; MFG_PN: 2N7002-7-F
R23 = RES_SMD_3.0K_0805_1/8W_1%: RES SMD 3.0K OHM 1% 1/8W 0805; MFG: Yageo; Case/Package: 0805; MFG_PN: RC0805FR-133KL; Supplier 1: DigiKey; Supplier Part Number 1: 13-RC0805FR-133KLCT-ND; Unit Price: .1
R24 R27 = RES_SMD_1.0K_0805_1/8W_1%: RES SMD 1.0K OHM 1% 1/8W 0805; MFG: Yageo; Case/Package: 0805; MFG_PN: RC0805FR-071KL; Supplier 1: DigiKey; Supplier Part Number 1: 311-1.00KCRCT-ND; Unit Price: .1
R25 R26 = RES_SMD_1.5K_0805_1/8W_0.1%: RES SMD 1.5K OHM 0.1% 1/8W 0805; MFG: Yageo; Case/Package: 0805; MFG_PN: RT0805BRD071K5L; Supplier 1: DigiKey; Supplier Part Number 1: YAG1814CT-ND; Unit Price: .16
R28-R30 = RES_SMD_10K_0805_1/4W_1%: RES SMD 10K OHM 1% 1/4W 0805; MFG: Yageo; Case/Package: 0805; MFG_PN: RC0805FR-7W10KL; Supplier 1: DigiKey; Supplier Part Number 1: 13-RC0805FR-7W10KLCT-ND; Unit Price: .10
REL1 = RELAY_HE721C0500: RELAY REED SPDT 250MA 5V; MFG: Littlefuse; Case/Package: HE700; Supplier 1: DigiKey; Supplier Part Number 1: HE112-ND; Unit Price: 3.77; MFG_PN: HE721C0500
TP5 TP8 = CONN_TEST_POINT_S1751-46R: PCB TEST POINT CONNECT; MFG: Harwin Inc; Case/Package: S1751; Supplier 1: Digi-Key; Supplier Part Number 1: 952-1478-1-ND; Value: *; Unit Price: .28; MFG_PN: S1751-46R
TP6 TP7 TP9 = CONN_TEST_POINT_TH_PAD_20MIL: TEST POINT TH 20MIL HOLE
U4 U6 = IC_AD7476ARTZ-REEL7: IC ADC 12BIT SAR SOT23-6; MFG: Analog Devices; Case/Package: SOT-23-6; Supplier 1: DigiKey; Supplier Part Number 1: AD7476ARTZ-REEL7CT-ND; Unit Price: 12.02; MFG_PN: AD7476ARTZ-REEL7
U5 = IC_OPAMP_AD8606ARZ-REEL7: IC OPAMP GP 2 CIRCUIT 8SOIC; MFG: Analog Devices; Unit Price: 4.94; Package/Case: SOIC-8; Supplier 1: DigiKey; Supplier Part Number 1: AD8606ARZ-REEL7CT-ND; MFG_PN: AD8606ARZ-REEL7

## Sheet SoftCore_SA_P5.SchDoc: =ProjectTitle
size B; Date: 02/26/26; Engineer: Hab S Collector; Address1: 3621 Gin Way; Address2: Snellville GA, 30039; DocumentNumber: IMR-006-SCH; Revision: 1; SheetNumber: 5; SheetTotal: 7
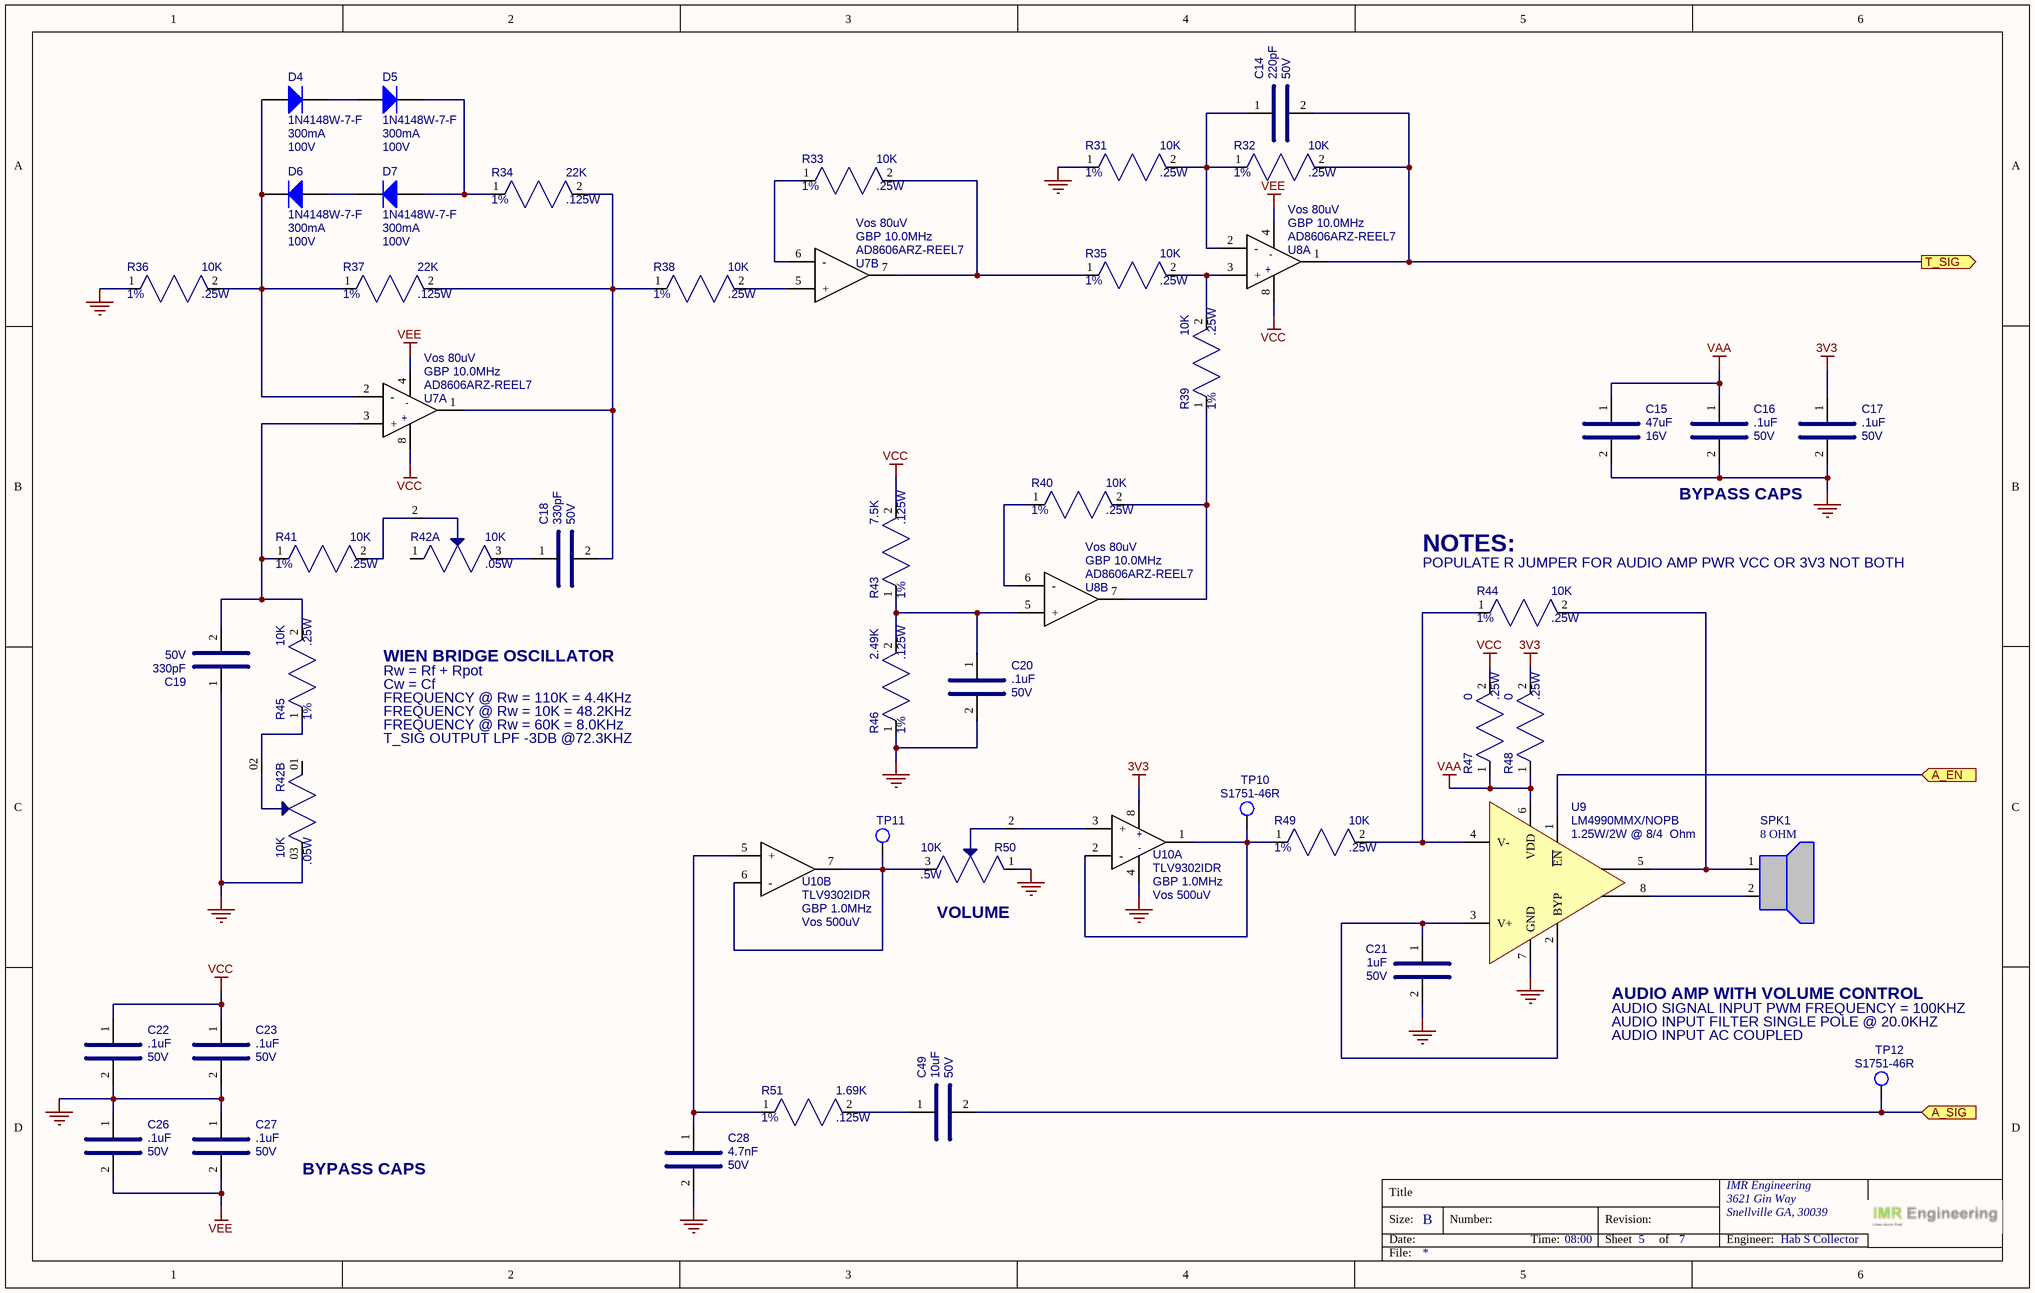
[diagram p4: SoftCore_SA_P5.SchDoc]

### Parts
C14  value 220pF  Voltage: 50V  [CAP_0805]  (hidden comment: CC0805JRNPO9BN221)
C15  value 47uF  Voltage: 16V  [CAP_1210]  (hidden comment: GRM32ER60J476ME20L)
C16  value .1uF  Voltage: 50V  [CAP_0805]  (hidden comment: KGM21NR71H104KT)
C17  value .1uF  Voltage: 50V  [CAP_0805]  (hidden comment: KGM21NR71H104KT)
C18  value 330pF  Voltage: 50V  [CAP_0805]  (hidden comment: CC0805JRNPO9BN331)
C19  value 330pF  Voltage: 50V  [CAP_0805]  (hidden comment: CC0805JRNPO9BN331)
C20  value .1uF  Voltage: 50V  [CAP_0805]  (hidden comment: KGM21NR71H104KT)
C21  value 1uF  Voltage: 50V  [CAP_0805]  (hidden comment: 08055C105K4T2A)
C22  value .1uF  Voltage: 50V  [CAP_0805]  (hidden comment: KGM21NR71H104KT)
C23  value .1uF  Voltage: 50V  [CAP_0805]  (hidden comment: KGM21NR71H104KT)
C26  value .1uF  Voltage: 50V  [CAP_0805]  (hidden comment: KGM21NR71H104KT)
C27  value .1uF  Voltage: 50V  [CAP_0805]  (hidden comment: KGM21NR71H104KT)
C28  value 4.7nF  Voltage: 50V  [CAP_0805]  (hidden comment: C0805C472K5RACAUTO)
C49  value 10uF  Voltage: 50V  [CAP_0805]  (hidden comment: GRM21BR61H106KE43L)
D4  value 100V  Current: 300mA  [SOD123]  (hidden comment: 1N4148W-7-F)
D5  value 100V  Current: 300mA  [SOD123]  (hidden comment: 1N4148W-7-F)
D6  value 100V  Current: 300mA  [SOD123]  (hidden comment: 1N4148W-7-F)
D7  value 100V  Current: 300mA  [SOD123]  (hidden comment: 1N4148W-7-F)
R31  value 10K  Power: .25W  Tolerance: 1%  [RES_0805]  (hidden comment: RC0805FR-7W10KL)
R32  value 10K  Power: .25W  Tolerance: 1%  [RES_0805]  (hidden comment: RC0805FR-7W10KL)
R33  value 10K  Power: .25W  Tolerance: 1%  [RES_0805]  (hidden comment: RC0805FR-7W10KL)
R34  value 22K  Power: .125W  Tolerance: 1%  [RES_0805]  (hidden comment: RC0805FR-0722KL)
R35  value 10K  Power: .25W  Tolerance: 1%  [RES_0805]  (hidden comment: RC0805FR-7W10KL)
R36  value 10K  Power: .25W  Tolerance: 1%  [RES_0805]  (hidden comment: RC0805FR-7W10KL)
R37  value 22K  Power: .125W  Tolerance: 1%  [RES_0805]  (hidden comment: RC0805FR-0722KL)
R38  value 10K  Power: .25W  Tolerance: 1%  [RES_0805]  (hidden comment: RC0805FR-7W10KL)
R39  value 10K  Power: .25W  Tolerance: 1%  [RES_0805]  (hidden comment: RC0805FR-7W10KL)
R40  value 10K  Power: .25W  Tolerance: 1%  [RES_0805]  (hidden comment: RC0805FR-7W10KL)
R41  value 10K  Power: .25W  Tolerance: 1%  [RES_0805]  (hidden comment: RC0805FR-7W10KL)
R42  value 10K  Power: .05W  [PRS12R-4]  (hidden comment: PRS12R-4115K-103B1)  (parts A,B of 2)
R43  value 7.5K  Power: .125W  Tolerance: 1%  [RES_0805]  (hidden comment: RC0805FR-077K5L)
R44  value 10K  Power: .25W  Tolerance: 1%  [RES_0805]  (hidden comment: RC0805FR-7W10KL)
R45  value 10K  Power: .25W  Tolerance: 1%  [RES_0805]  (hidden comment: RC0805FR-7W10KL)
R46  value 2.49K  Power: .125W  Tolerance: 1%  [RES_0805]  (hidden comment: RC0805FR-132K49L)
R47  value 0  Power: .25W  [RES_0805]  (hidden comment: RC0805JR-070RL)
R48  value 0  Power: .25W  [RES_0805]  (hidden comment: RC0805JR-070RL)
R49  value 10K  Power: .25W  Tolerance: 1%  [RES_0805]  (hidden comment: RC0805FR-7W10KL)
R50  value 10K  Power: .5W  [BOURNS_3386F]  (hidden comment: 3386P-1-103TLF)
R51  value 1.69K  Power: .125W  Tolerance: 1%  [RES_0805]  (hidden comment: RC0805FR-071K69L)
SPK1  value 8 OHM  [HDR_1X2_100MILL]  (hidden comment: TBD)
TP10  S1751-46R  [HARWIN_S1751]
TP11  (no value)  [TEST_POINT_20MIL_TH]  (no BOM)
TP12  S1751-46R  [HARWIN_S1751]
U7  value GBP 10.0MHz  Vos: Vos 80uV  [SOIC-8_54]  (hidden comment: AD8606ARZ-REEL7)  (parts A,B of 2)
U8  value GBP 10.0MHz  Vos: Vos 80uV  [SOIC-8_54]  (hidden comment: AD8606ARZ-REEL7)  (parts A,B of 2)
U9  value 1.25W/2W @ 8/4  Ohm  [SOP65P490X110-8N]  (hidden comment: LM4990MMX/NOPB)
U10  value GBP 1.0MHz  Vos: Vos 500uV  [SOIC-8_49]  (hidden comment: TLV9302IDR)  (parts A,B of 2)

### Ports
A_EN (in), A_SIG (in), T_SIG (out)

### Nets
3V3: C17.1 R48.2 U10.8
GND: C15.2 C16.2 C17.2 C19.1 C20.2 C21.2 C22.2 C23.2 C26.1 C27.1 C28.2 R31.1 R36.1 R42.03 R46.1 R50.1 U9.7(GND) U10.4
VAA: C15.1 C16.1 R47.1 R48.1 U9.6(VDD)
VCC: C22.1 C23.1 R43.2 R47.2 U7.8 U8.8
VEE: C26.2 C27.2 U7.4 U8.4
A_SIG: C49.2 TP12.1 ; port A_SIG
NetC14_1: C14.1 R31.2 R32.1 U8.2(-)
NetC14_2: C14.2 R32.2 U8.1 ; port T_SIG
NetC18_1: C18.1 R42.3
NetC18_2: C18.2 R34.2 R37.2 R38.1 U7.1
NetC19_2: C19.2 R41.1 R45.2 U7.3(+)
NetC20_1: C20.1 R43.1 R46.2 U8.5(+)
NetC21_1: C21.1 U9.2(BYP) U9.3(V+)
NetC28_1: C28.1 R51.1 U10.5(+)
NetC49_1: C49.1 R51.2
NetD4_1: D4.1(A) D6.2(K) R36.2 R37.1 U7.2(-)
NetD4_2: D4.2(K) D5.1(A)
NetD5_2: D5.2(K) D7.1(A) R34.1
NetD6_1: D6.1(A) D7.2(K)
NetJ6_7: U9.1(~{EN}) ; port A_EN
NetR33_1: R33.1 U7.6(-)
NetR33_2: R33.2 R35.1 U7.7
NetR35_2: R35.2 R39.2 U8.3(+)
NetR38_2: R38.2 U7.5(+)
NetR39_1: R39.1 R40.2 U8.7
NetR40_1: R40.1 U8.6(-)
NetR41_2: R41.2 R42.2
NetR42_02: R42.02 R45.1
NetR44_1: R44.1 R49.2 U9.4(V-)
NetR44_2: R44.2 SPK1.1 U9.5(VO1)
NetR49_1: R49.1 TP10.1 U10.1 U10.2(-)
NetR50_2: R50.2 U10.3(+)
NetR50_3: R50.3 TP11.1 U10.6(-) U10.7
NetSPK1_2: SPK1.2 U9.8(VO2)

Not connected (* = marked no-connect by the designer): R42 1 01

### Notes on the sheet
- BYPASS CAPS
- NOTES:
- (near R44) POPULATE R JUMPER FOR AUDIO AMP PWR VCC OR 3V3 NOT BOTH
- WIEN BRIDGE OSCILLATOR
- FREQUENCY @ Rw = 110K = 4.4KHz
- Rw = Rf + Rpot
- Cw = Cf
- FREQUENCY @ Rw = 10K = 48.2KHz
- FREQUENCY @ Rw = 60K = 8.0KHz
- T_SIG OUTPUT LPF -3DB @72.3KHZ
- (near R50) VOLUME
- (near U9) AUDIO AMP WITH VOLUME CONTROL
- AUDIO SIGNAL INPUT PWM FREQUENCY = 100KHZ
- AUDIO INPUT FILTER SINGLE POLE @ 20.0KHZ
- AUDIO INPUT AC COUPLED
- Title
- Size:
- Date:
- B
- Number:
- Time:
- Revision:
- Sheet
- of
- IMR Engineering
- Engineer:
- File:

### Library data of the parts
C14 = CAP_SMD_220PF_50V_0805: as C9 on sheet SoftCore_SA_P4; Case/Package: 0805; MFG_PN: CC0805JRNPO9BN221; Supplier 1: DigiKey; Supplier Part Number 1: 311-1115-1-ND; Unit Price: .11
C15 = CAP_SMD_47UF_16V_1210: as C1 on sheet SoftCore_SA_P2; Case/Package: 1210; MFG_PN: GRM32ER60J476ME20L; Supplier 1: DigiKey; Supplier Part Number 1: 490-1887-1-ND; Unit Price: .28
C16 C17 C20 C22 C23 C26 C27 = CAP_SMD_0.1UF_50V_0805: as C2 on sheet SoftCore_SA_P2; Case/Package: 0805; MFG_PN: KGM21NR71H104KT; Supplier 1: DigiKey; Supplier Part Number 1: 478-KGM21NR71H104KTCT-ND; Unit Price: .1
C18 C19 = CAP_SMD_330PF_50V_0805: CAP CER 3300PF 50V COG/NP0 0805; MFG: Yageo; Type: COG, NP0; Tolerance: 5%; Case/Package: 0805; MFG_PN: CC0805JRNPO9BN331; Supplier 1: DigiKey; Supplier Part Number 1: 311-1117-1-ND; Unit Price: .11
C21 = CAP_SMD_1UF_50V_0805: CAP CER 1UF 50V X7R 0805; MFG: KYOCERA AVX; Case/Package: 0805; MFG_PN: 08055C105K4T2A; Supplier 1: DigiKey; Supplier Part Number 1: 478-KAM21KR71H105KUCT-ND; Unit Price: .27
C28 = CAP_SMD_4.7NF_50V_0805: CAP CER 4.7NF 50V X7R 0805; MFG: KEMET; Case/Package: 0805; MFG_PN: C0805C472K5RACAUTO; Supplier 1: DigiKey; Supplier Part Number 1: 399-6969-1-ND; Unit Price: .12
C49 = CAP_SMD_10UF_50V_0805: as C8 on sheet SoftCore_SA_P4; Case/Package: 0805; MFG_PN: GRM21BR61H106KE43L; Supplier 1: DigiKey; Supplier Part Number 1: 490-18663-1-ND; Unit Price: .28
D4-D7 = DIODE_1N4148W-7-F: as D1 on sheet SoftCore_SA_P4; Case/Package: SOD-123; Supplier 1: DigiKey; Supplier Part Number 1: 1N4148W-FDICT-ND; Unit Price: .16; MFG_PN: 1N4148W-7-F
R31-R33 R35 R36 R38-R41 R44 R45 R49 = RES_SMD_10K_0805_1/4W_1%: RES SMD 10K OHM 1% 1/4W 0805; MFG: Yageo; Case/Package: 0805; MFG_PN: RC0805FR-7W10KL; Supplier 1: DigiKey; Supplier Part Number 1: 13-RC0805FR-7W10KLCT-ND; Unit Price: .10
R34 R37 = RES_SMD_22K_0805_1/8W_1%: RES SMD 22K OHM 1% 1/8W 0805; MFG: Yageo; Case/Package: 0805; MFG_PN: RC0805FR-0722KL; Supplier 1: DigiKey; Supplier Part Number 1: 311-22.0KCRCT-ND; Unit Price: .10
R42 = RES_POT_10K_2XGANG_LINEAR: POT 10K OHM 1/20W LINEAR - 2X GANG; MFG: Bourns Inc.; Case/Package: PRS12R-4; MFG_PN: PRS12R-4115K-103B1; Supplier 1: DigiKey; Supplier Part Number 1: 118-PRS12R-4115K-103B1-ND; Unit Price: 2.56
R43 = RES_SMD_7.5K_0805_1/8W_1%: RES SMD 7.5K OHM 1% 1/8W 0805; MFG: Yageo; Case/Package: 0805; MFG_PN: RC0805FR-077K5L; Supplier 1: DigiKey; Supplier Part Number 1: 311-7.50KCRCT-ND; Unit Price: .10
R46 = RES_SMD_2.49K_0805_1/8W_1%: RES SMD 2.49K OHM 1% 1/8W 0805; MFG: Yageo; Case/Package: 0805; MFG_PN: RC0805FR-132K49L; Supplier 1: DigiKey; Supplier Part Number 1: 13-RC0805FR-132K49LCT-ND; Unit Price: .1
R47 R48 = RES_SMD_0_0805_1/8W_1%: RES SMD 0 OHM 1% 1/8W 0805; MFG: Yageo; Case/Package: 0805; MFG_PN: RC0805JR-070RL; Supplier 1: DigiKey; Supplier Part Number 1: 311-0.0ARCT-ND; Unit Price: .1; Tolerance: 1%
R50 = RES_POT_10K_1XGANG_LINEAR: POT 10K OHM 1/20W LINEAR - 1X GANG; MFG: Bourns Inc.; Case/Package: PRS12R-4; MFG_PN: 3386P-1-103TLF; Supplier 1: DigiKey; Supplier Part Number 1: 3386P-103TLF-ND; Unit Price: 2.20
R51 = RES_SMD_1.69K_0805_1/8W_1%: RES SMD 1.69K OHM 1% 1/8W 0805; MFG: Yageo; Case/Package: 0805; MFG_PN: RC0805FR-071K69L; Supplier 1: DigiKey; Supplier Part Number 1: 311-1.69KCRCT-ND; Unit Price: .1
SPK1 = CONN_SPKR_HEADER_2P_100MIL: CONN SPEAKER HEADER GENERIC VERT 2POS 2.54MM; Case/Package: 2P_2.54MM; MFG: GENERIC; Supplier 1: Digi-Key; Supplier Part Number 1: TBD; Unit Price: 1.00; MFG_PN: TBD
TP10 TP12 = CONN_TEST_POINT_S1751-46R: PCB TEST POINT CONNECT; MFG: Harwin Inc; Case/Package: S1751; Supplier 1: Digi-Key; Supplier Part Number 1: 952-1478-1-ND; Value: *; Unit Price: .28; MFG_PN: S1751-46R
TP11 = CONN_TEST_POINT_TH_PAD_20MIL: TEST POINT TH 20MIL HOLE
U7 U8 = IC_OPAMP_AD8606ARZ-REEL7: as U5 on sheet SoftCore_SA_P4; Unit Price: 4.94; Package/Case: SOIC-8; Supplier 1: DigiKey; Supplier Part Number 1: AD8606ARZ-REEL7CT-ND; MFG_PN: AD8606ARZ-REEL7
U9 = IC_LM4990MMX/NOPB: IC AMP CLASS AB MONO 2W 8VSSOP; MFG: Texas Instruments; Case/Package: SC-70-6; Supplier 1: DigiKey; Supplier Part Number 1: 296-37579-1-ND; Unit Price: .45; MFG_PN: LM4990MMX/NOPB
U10 = IC_OPAMP_TLV9302IDR: IC OPAMP GP 2 CIRCUIT 8SOIC; MFG: Texas Instruments; Unit Price: .66; Package/Case: SOIC-8; Supplier 1: DigiKey; Supplier Part Number 1: 296-53513-1-ND; MFG_PN: TLV9302IDR

## Sheet SoftCore_SA_P6.SchDoc: =ProjectTitle
size B; Date: 02/26/26; Engineer: Hab S Collector; Address1: 3621 Gin Way; Address2: Snellville GA, 30039; DocumentNumber: IMR-006-SCH; Revision: 1; SheetNumber: 6; SheetTotal: 7
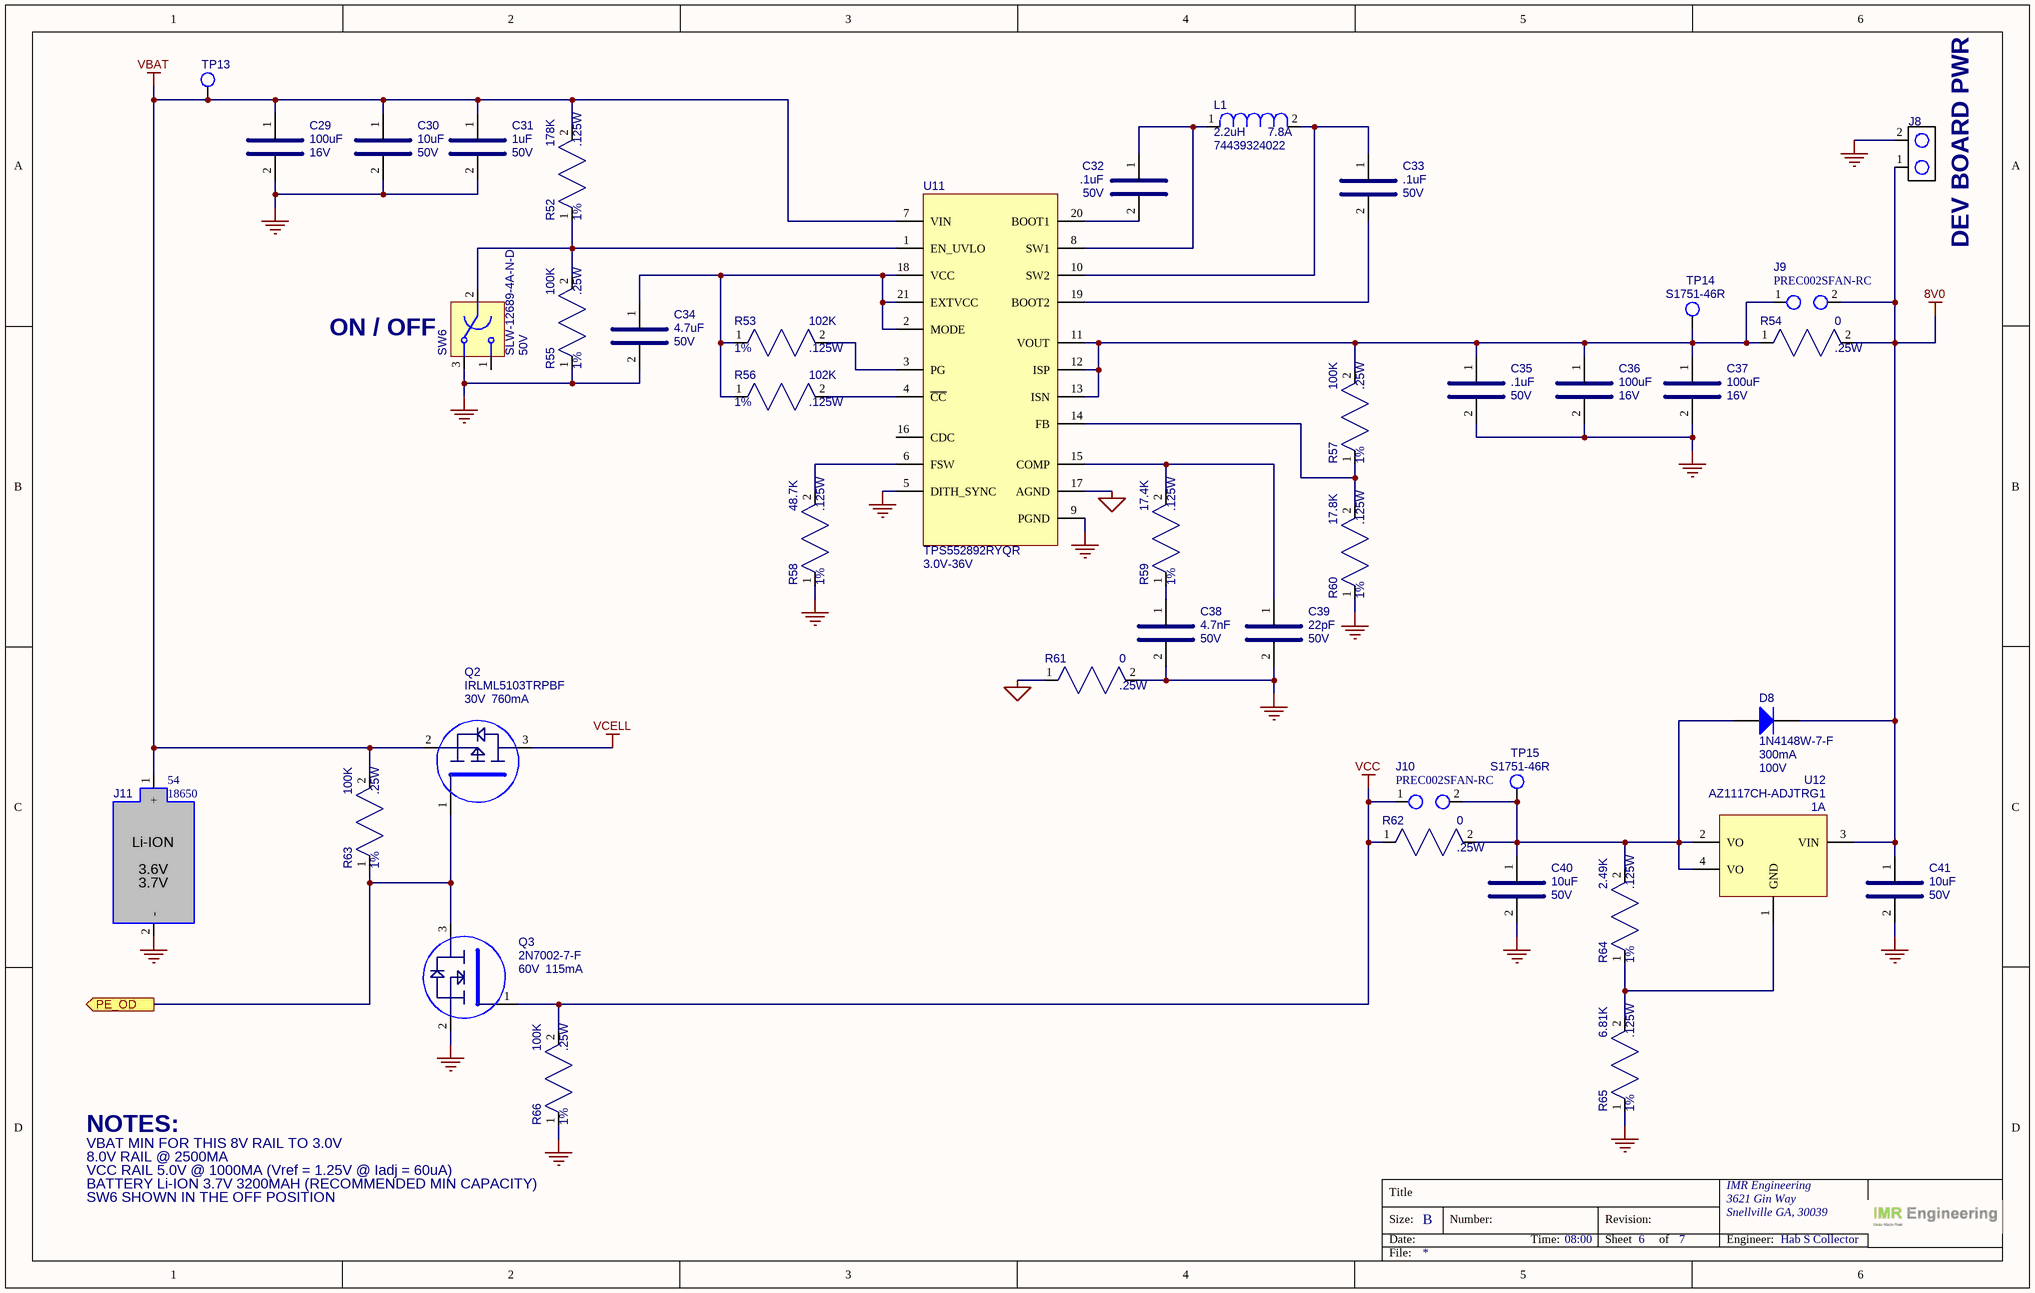
[diagram p5: SoftCore_SA_P6.SchDoc]

### Parts
C29  value 100uF  Voltage: 16V  [CAP_1210]  (hidden comment: EMK325ABJ107MM-P)
C30  value 10uF  Voltage: 50V  [CAP_0805]  (hidden comment: GRM21BR61H106KE43L)
C31  value 1uF  Voltage: 50V  [CAP_0805]  (hidden comment: 08055C105K4T2A)
C32  value .1uF  Voltage: 50V  [CAP_0805]  (hidden comment: KGM21NR71H104KT)
C33  value .1uF  Voltage: 50V  [CAP_0805]  (hidden comment: KGM21NR71H104KT)
C34  value 4.7uF  Voltage: 50V  [CAP_0805]  (hidden comment: GRM21BR61H475KE51L)
C35  value .1uF  Voltage: 50V  [CAP_0805]  (hidden comment: KGM21NR71H104KT)
C36  value 100uF  Voltage: 16V  [CAP_1210]  (hidden comment: EMK325ABJ107MM-P)
C37  value 100uF  Voltage: 16V  [CAP_1210]  (hidden comment: EMK325ABJ107MM-P)
C38  value 4.7nF  Voltage: 50V  [CAP_0805]  (hidden comment: C0805C472K5RACAUTO)
C39  value 22pF  Voltage: 50V  [CAP_0805]  (hidden comment: C0805C220K5RACAUTO)
C40  value 10uF  Voltage: 50V  [CAP_0805]  (hidden comment: GRM21BR61H106KE43L)
C41  value 10uF  Voltage: 50V  [CAP_0805]  (hidden comment: GRM21BR61H106KE43L)
D8  value 100V  Current: 300mA  [SOD123]  (hidden comment: 1N4148W-7-F)
J8  PREC002SFAN-RC  [HDR_1X2_100MILL]  (value not drawn)
J9  PREC002SFAN-RC  [HDR_1X2_100MILL]
J10  PREC002SFAN-RC  [HDR_1X2_100MILL]
J11  value 18650  [CONN_BATTERY_18650]  (hidden comment: 54)
L1  value 2.2uH  Current: 7.8A  [WE-XHMI_4030]  (hidden comment: 74439324022)
Q2  value 30V  Current: 760mA  [SOT-23]  (hidden comment: IRLML5103TRPBF)
Q3  value 60V  Current: 115mA  [SOT-23]  (hidden comment: 2N7002-7-F)
R52  value 178K  Power: .125W  Tolerance: 1%  [RES_0805]  (hidden comment: RC0805FR-07178KL)
R53  value 102K  Power: .125W  Tolerance: 1%  [RES_0805]  (hidden comment: RC0805FR-07102KL)
R54  value 0  Power: .25W  [RES_0805]  (hidden comment: RC0805JR-070RL)
R55  value 100K  Power: .25W  Tolerance: 1%  [RES_0805]  (hidden comment: RC0805FR-07100KL)
R56  value 102K  Power: .125W  Tolerance: 1%  [RES_0805]  (hidden comment: RC0805FR-07102KL)
R57  value 100K  Power: .25W  Tolerance: 1%  [RES_0805]  (hidden comment: RC0805FR-07100KL)
R58  value 48.7K  Power: .125W  Tolerance: 1%  [RES_0805]  (hidden comment: RC0805FR-0748K7L)
R59  value 17.4K  Power: .125W  Tolerance: 1%  [RES_0805]  (hidden comment: RC0805FR-0717K4L)
R60  value 17.8K  Power: .125W  Tolerance: 1%  [RES_0805]  (hidden comment: RC0805FR-0717K8L)
R61  value 0  Power: .25W  [RES_0805]  (hidden comment: RC0805JR-070RL)
R62  value 0  Power: .25W  [RES_0805]  (hidden comment: RC0805JR-070RL)
R63  value 100K  Power: .25W  Tolerance: 1%  [RES_0805]  (hidden comment: RC0805FR-07100KL)
R64  value 2.49K  Power: .125W  Tolerance: 1%  [RES_0805]  (hidden comment: RC0805FR-132K49L)
R65  value 6.81K  Power: .125W  Tolerance: 1%  [RES_0805]  (hidden comment: RC0805FR-076K81L)
R66  value 100K  Power: .25W  Tolerance: 1%  [RES_0805]  (hidden comment: RC0805FR-07100KL)
SW6  value 50V  [SLW126894AND]  (hidden comment: SLW-12689-4A-N-D)
TP13  (no value)  [TEST_POINT_20MIL_TH]  (no BOM)
TP14  S1751-46R  [HARWIN_S1751]
TP15  S1751-46R  [HARWIN_S1751]
U11  value 3.0V-36V  [CONV_TPS552892RYQR]  (hidden comment: TPS552892RYQR)
U12  Current: 1A  [SOT223]  (hidden comment: AZ1117CH-ADJTRG1)

### Ports
PE_OD (out)

### Nets
8V0: C41.1 D8.2(K) J8.1 J9.2 R54.2 U12.3(VIN)
AGND: R61.1 U11.17(AGND)
GND: C29.2 C30.2 C31.2 C34.2 C35.2 C36.2 C37.2 C38.2 C39.2 C40.2 C41.2 J8.2 J11.2(-) Q3.2(E) R55.1 R58.1 R60.1 R61.2 R65.1 R66.1 SW6.3 U11.5(DITH_SYNC) U11.9(PGND)
VBAT: C29.1 C30.1 C31.1 J11.1(+) Q2.2(S) R52.2 R63.2 TP13.1 U11.7(VIN)
VCC: J10.1 Q3.1(B) R62.1 R66.2
VCELL: Q2.3(D)
NetC32_1: C32.1 L1.1 U11.8(SW1)
NetC32_2: C32.2 U11.20(BOOT1)
NetC33_1: C33.1 L1.2 U11.10(SW2)
NetC33_2: C33.2 U11.19(BOOT2)
NetC34_1: C34.1 R53.1 R56.1 U11.2(MODE) U11.18(VCC) U11.21(EXTVCC)
NetC35_1: C35.1 C36.1 C37.1 J9.1 R54.1 R57.2 TP14.1 U11.11(VOUT) U11.12(ISP) U11.13(ISN)
NetC38_1: C38.1 R59.1
NetC39_1: C39.1 R59.2 U11.15(COMP)
NetC40_1: C40.1 D8.1(A) J10.2 R62.2 R64.2 TP15.1 U12.2(VO) U12.4(VO)
NetQ2_1: Q2.1(G) Q3.3(C) R63.1 ; port PE_OD
NetR52_1: R52.1 R55.2 SW6.2 U11.1(EN_UVLO)
NetR53_2: R53.2 U11.3(PG)
NetR56_2: R56.2 U11.4(~{CC})
NetR57_1: R57.1 R60.2 U11.14(FB)
NetR58_2: R58.2 U11.6(FSW)
NetR64_1: R64.1 R65.2 U12.1(GND)

Not connected (* = marked no-connect by the designer): SW6 1; U11 16(CDC)

### Notes on the sheet
- (near J8) DEV BOARD PWR
- (near SW6) ON / OFF
- VBAT MIN FOR THIS 8V RAIL TO 3.0V
- NOTES:
- 8.0V RAIL @ 2500MA
- VCC RAIL 5.0V @ 1000MA (Vref = 1.25V @ Iadj = 60uA)
- BATTERY Li-ION 3.7V 3200MAH (RECOMMENDED MIN CAPACITY)
- SW6 SHOWN IN THE OFF POSITION
- Title
- Size:
- Date:
- B
- Number:
- Time:
- Revision:
- Sheet
- of
- IMR Engineering
- Engineer:
- File:
- (in symbol CONN_BATT_18650) Li-ION; 3.6V; 3.7V

### Library data of the parts
C29 C36 C37 = CAP_SMD_100UF_16V_SMD: CAP CER 100UF 16V X7S SMD; MFG: Taiyo Yuden; Case/Package: CAPC6153X670N; MFG_PN: EMK325ABJ107MM-P; Supplier 1: DigiKey; Supplier Part Number 1: 587-5426-1-ND; Unit Price: 1.92
C30 C40 C41 = CAP_SMD_10UF_50V_0805: as C8 on sheet SoftCore_SA_P4; Case/Package: 0805; MFG_PN: GRM21BR61H106KE43L; Supplier 1: DigiKey; Supplier Part Number 1: 490-18663-1-ND; Unit Price: .28
C31 = CAP_SMD_1UF_50V_0805: as C21 on sheet SoftCore_SA_P5; Case/Package: 0805; MFG_PN: 08055C105K4T2A; Supplier 1: DigiKey; Supplier Part Number 1: 478-KAM21KR71H105KUCT-ND; Unit Price: .27
C32 C33 C35 = CAP_SMD_0.1UF_50V_0805: as C2 on sheet SoftCore_SA_P2; Case/Package: 0805; MFG_PN: KGM21NR71H104KT; Supplier 1: DigiKey; Supplier Part Number 1: 478-KGM21NR71H104KTCT-ND; Unit Price: .1
C34 = CAP_SMD_4.7UF_50V_0805: CAP CER 4.7UF 50V X5R 0805; MFG: Murata Electronics; Case/Package: 0805; MFG_PN: GRM21BR61H475KE51L; Supplier 1: DigiKey; Supplier Part Number 1: 490-10751-1-ND; Unit Price: .19
C38 = CAP_SMD_4.7NF_50V_0805: CAP CER 4.7NF 50V X7R 0805; MFG: KEMET; Case/Package: 0805; MFG_PN: C0805C472K5RACAUTO; Supplier 1: DigiKey; Supplier Part Number 1: 399-6969-1-ND; Unit Price: .12
C39 = CAP_SMD_22PF_50V_0805: CAP CER 22PF 50V X7R 0805; MFG: KEMET; Case/Package: 0805; MFG_PN: C0805C220K5RACAUTO; Supplier 1: DigiKey; Supplier Part Number 1: 399-17627-1-ND; Unit Price: .24
D8 = DIODE_1N4148W-7-F: as D1 on sheet SoftCore_SA_P4; Case/Package: SOD-123; Supplier 1: DigiKey; Supplier Part Number 1: 1N4148W-FDICT-ND; Unit Price: .16; MFG_PN: 1N4148W-7-F
J8 = CONN_HEADER_2P_100MIL_VERT: CONN HEADER VERT 2POS 2.54MM; MFG: Sullins Connector Solutions; Case/Package: 2P_2.54MM; Supplier 1: Digi-Key; Supplier Part Number 1: S1212EC-02-ND; Value: *; Unit Price: .07; MFG_PN: PREC002SFAN-RC
J9 J10 = CONN_JUMPER_2P_100MIL_VERT: CONN HEADER VERT 2POS 2.54MM; MFG: Sullins Connector Solutions; Case/Package: 2P_2.54MM; MFG_PN: PREC002SFAN-RC; Supplier 1: Digi-Key; Supplier Part Number 1: S1212EC-02-ND; Value: *; Unit Price: .07
J11 = CONN_BATT_18650: CONN HEADER VERT 2POS 2.54MM; MFG: Keystone Electronics; Note: This is actually 2 connectors on PCB - priced as such but BOM will reflect only one; Case/Package: 18650 SINGLE CELL; Supplier 1: Digi-Key; Supplier Part Number 1: 36-54-ND; Unit Price: 1.10; MFG_PN: 54
L1 = INDUCTOR_74439324022: POWER INDUCTOR 4030; 2.2UH; 7.80; MFG: Würth Elektronik; Tolerance: 20%; Case/Package: WE-XHMI; Supplier 1: DigiKey; Supplier Part Number 1: 732-74439324022CT-ND; Unit Price: 1.80; MFG_PN: 74439324022
Q2 = MOSFET_PCH_IRLML5103TRPBF: MOSFET P-CH 30V 760MA SOT23; MFG: Infineon Technologies; Case/Package: 8-PowerTDFN; Supplier 1: DigiKey; Supplier Part Number 1: IRLML5103PBFCT-ND; Unit Price: .45; MFG_PN: IRLML5103TRPBF
Q3 = MOSFET_NCH_2N7002-7-F: as Q1 on sheet SoftCore_SA_P4; Case/Package: SOT-23; Supplier 1: DigiKey; Supplier Part Number 1: 2N7002-FDICT-ND; Unit Price: .20; MFG_PN: 2N7002-7-F
R52 = RES_SMD_178K_0805_1/8W_1%: RES SMD 178K OHM 1% 1/8W 0805; MFG: Yageo; Case/Package: 0805; MFG_PN: RC0805FR-07178KL; Supplier 1: DigiKey; Supplier Part Number 1: 311-178KCRCT-ND; Unit Price: .10
R53 R56 = RES_SMD_102K_0805_1/8W_1%: RES SMD 102K OHM 1% 1/8W 0805; MFG: Yageo; Case/Package: 0805; MFG_PN: RC0805FR-07102KL; Supplier 1: DigiKey; Supplier Part Number 1: 311-102KCRCT-ND; Unit Price: .10
R54 R61 R62 = RES_SMD_0_0805_1/8W_1%: RES SMD 0 OHM 1% 1/8W 0805; MFG: Yageo; Case/Package: 0805; MFG_PN: RC0805JR-070RL; Supplier 1: DigiKey; Supplier Part Number 1: 311-0.0ARCT-ND; Unit Price: .1; Tolerance: 1%
R55 R57 R63 R66 = RES_SMD_100K_0805_1/4W_1%: RES SMD 100K OHM 1% 1/4W 0805; MFG: Yageo; Case/Package: 0805; MFG_PN: RC0805FR-07100KL; Supplier 1: DigiKey; Supplier Part Number 1: 311-100KCRCT-ND; Unit Price: .13
R58 = RES_SMD_48.7K_0805_1/8W_1%: RES SMD 48.7K OHM 1% 1/8W 0805; MFG: Yageo; Case/Package: 0805; MFG_PN: RC0805FR-0748K7L; Supplier 1: DigiKey; Supplier Part Number 1: 311-48.7KCRCT-ND; Unit Price: .1
R59 = RES_SMD_17.4K_0805_1/8W_1%: RES SMD 17.4K OHM 1% 1/8W 0805; MFG: Yageo; Case/Package: 0805; MFG_PN: RC0805FR-0717K4L; Supplier 1: DigiKey; Supplier Part Number 1: 311-17.4KCRCT-ND; Unit Price: .10
R60 = RES_SMD_17.8K_0805_1/8W_1%: RES SMD 17.8K OHM 1% 1/8W 0805; MFG: Yageo; Case/Package: 0805; MFG_PN: RC0805FR-0717K8L; Supplier 1: DigiKey; Supplier Part Number 1: 311-17.8KCRCT-ND; Unit Price: .10
R64 = RES_SMD_2.49K_0805_1/8W_1%: as R46 on sheet SoftCore_SA_P5; Case/Package: 0805; MFG_PN: RC0805FR-132K49L; Supplier 1: DigiKey; Supplier Part Number 1: 13-RC0805FR-132K49LCT-ND; Unit Price: .1
R65 = RES_SMD_6.81K_0805_1/8W_1%: RES SMD 6.81K OHM 1% 1/8W 0805; MFG: Yageo; Case/Package: 0805; MFG_PN: RC0805FR-076K81L; Supplier 1: DigiKey; Supplier Part Number 1: 311-6.81KCRCT-ND; Unit Price: .10
SW6 = SWITCH_SLW-12689-4A-N-D: SWITCH SLIDE SPDT 300MA 50V; MFG: Same Sky; Case/Package: SLW-12689-4A-N-D; Supplier 1: DigiKey; Supplier Part Number 1: 2223-SLW-12689-4A-N-D-ND; Unit Price: .48; Current: 300mA; MFG_PN: SLW-12689-4A-N-D
TP13 = CONN_TEST_POINT_TH_PAD_20MIL: TEST POINT TH 20MIL HOLE
TP14 TP15 = CONN_TEST_POINT_S1751-46R: PCB TEST POINT CONNECT; MFG: Harwin Inc; Case/Package: S1751; Supplier 1: Digi-Key; Supplier Part Number 1: 952-1478-1-ND; Value: *; Unit Price: .28; MFG_PN: S1751-46R
U11 = IC_SMPS_TPS552892RYQR: IC REG BUCK ADJ 1A 16HTSSOP; MFG: Texas Instruments; Current: 8A; Case/Package: VQFN; Supplier 1: DigiKey; Supplier Part Number 1: 296-TPS552892RYQRCT-ND; Unit Price: 6.42; MFG_PN: TPS552892RYQR
U12 = IC_REG_AZ1117CH-ADJTRG1: IC REG BUCK ADJ 2A SOT23; MFG: Diodes Incorporated; Case/Package: SOT-223-3; Supplier 1: DigiKey; Supplier Part Number 1: AZ1117CH-ADJTRG1DICT-ND; Unit Price: .2; VALUE: ADJ; MFG_PN: AZ1117CH-ADJTRG1

## Sheet SoftCore_SA_P7.SchDoc: =ProjectTitle
size B; Date: 02/26/26; Engineer: Hab S Collector; Address1: 3621 Gin Way; Address2: Snellville GA, 30039; DocumentNumber: IMR-006-SCH; Revision: 1; SheetNumber: 7; SheetTotal: 7
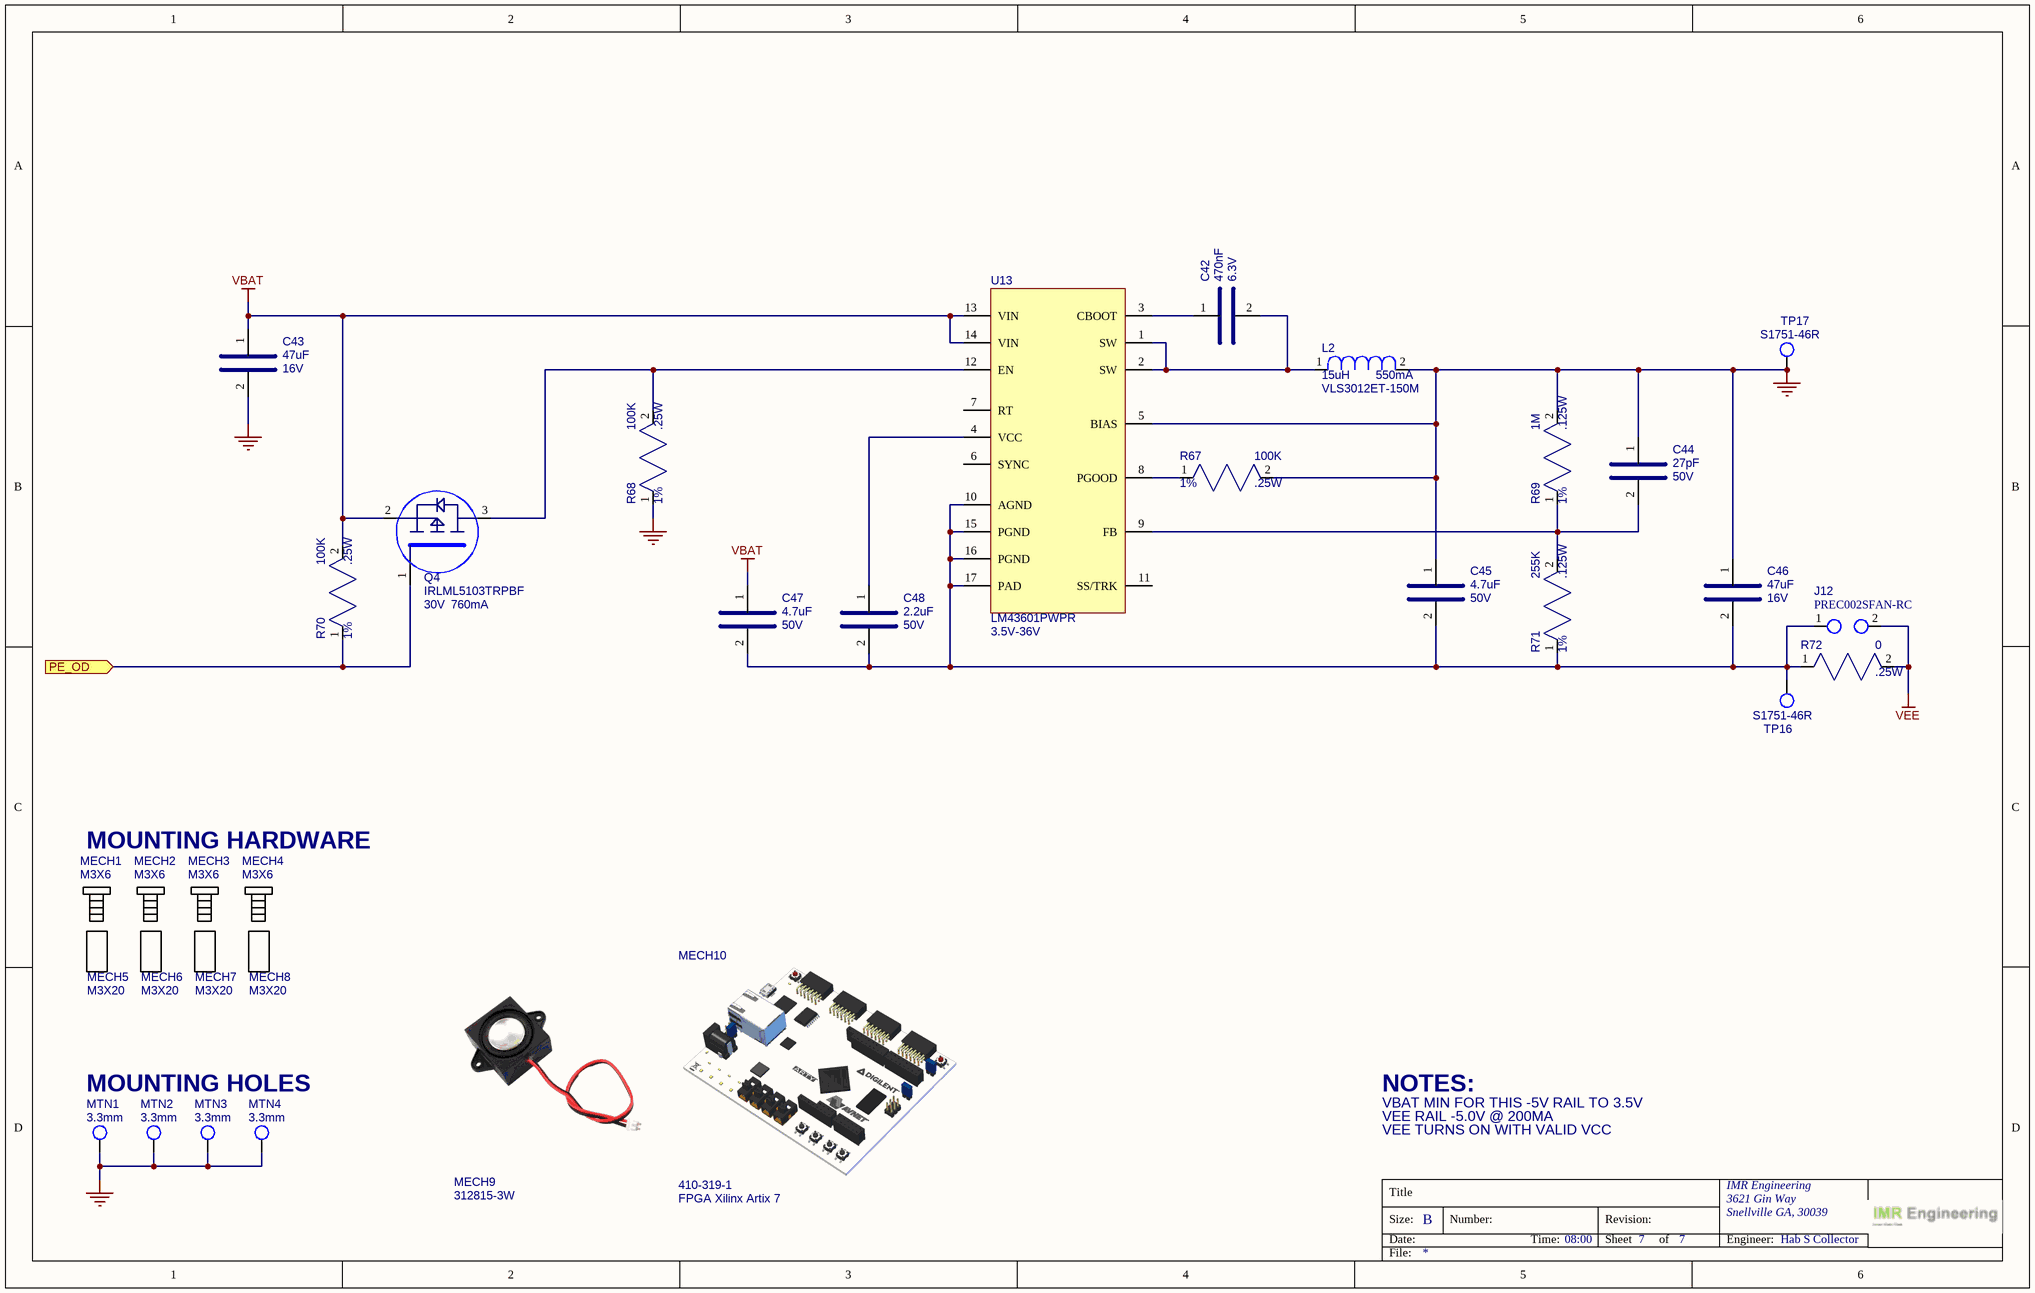
[diagram p6: SoftCore_SA_P7.SchDoc]

### Parts
C42  value 470nF  Voltage: 6.3V  [CAP_0805]  (hidden comment: GRM155R60J474KE19D)
C43  value 47uF  Voltage: 16V  [CAP_1210]  (hidden comment: GRM32ER60J476ME20L)
C44  value 27pF  Voltage: 50V  [CAP_0805]  (hidden comment: C0805C270J5GACTU)
C45  value 4.7uF  Voltage: 50V  [CAP_0805]  (hidden comment: GRM21BR61H475KE51L)
C46  value 47uF  Voltage: 16V  [CAP_1210]  (hidden comment: GRM32ER60J476ME20L)
C47  value 4.7uF  Voltage: 50V  [CAP_0805]  (hidden comment: GRM21BR61H475KE51L)
C48  value 2.2uF  Voltage: 50V  [CAP_0805]  (hidden comment: GRM219R61E225KA12J)
J12  PREC002SFAN-RC  [HDR_1X2_100MILL]
L2  value 15uH  Current: 550mA  [IND_VLS3012ET-150M]  (hidden comment: VLS3012ET-150M)
MECH1  Size: M3X6  [MECHANICAL_SCREW_M3X6]  (hidden comment: RM3X6MM 2701)
MECH2  Size: M3X6  [MECHANICAL_SCREW_M3X6]  (hidden comment: RM3X6MM 2701)
MECH3  Size: M3X6  [MECHANICAL_SCREW_M3X6]  (hidden comment: RM3X6MM 2701)
MECH4  Size: M3X6  [MECHANICAL_SCREW_M3X6]  (hidden comment: RM3X6MM 2701)
MECH5  Size: M3X20  [MECHANICAL_SPACER_F_F_M3X20]  (hidden comment: 24407)
MECH6  Size: M3X20  [MECHANICAL_SPACER_F_F_M3X20]  (hidden comment: 24407)
MECH7  Size: M3X20  [MECHANICAL_SPACER_F_F_M3X20]  (hidden comment: 24407)
MECH8  Size: M3X20  [MECHANICAL_SPACER_F_F_M3X20]  (hidden comment: 24407)
MECH9  312815-3W  [312815-3W_PCB]
MECH10  value FPGA Xilinx Artix 7  [ARTY_A7_DEV_BOARD]  (hidden comment: 410-319-1)
MTN1  Hole Size: 3.3mm  [PMG_MT_HOLE_3.3MM]  (no BOM)
MTN2  Hole Size: 3.3mm  [PMG_MT_HOLE_3.3MM]  (no BOM)
MTN3  Hole Size: 3.3mm  [PMG_MT_HOLE_3.3MM]  (no BOM)
MTN4  Hole Size: 3.3mm  [PMG_MT_HOLE_3.3MM]  (no BOM)
Q4  value 30V  Current: 760mA  [SOT-23]  (hidden comment: IRLML5103TRPBF)
R67  value 100K  Power: .25W  Tolerance: 1%  [RES_0805]  (hidden comment: RC0805FR-07100KL)
R68  value 100K  Power: .25W  Tolerance: 1%  [RES_0805]  (hidden comment: RC0805FR-07100KL)
R69  value 1M  Power: .125W  Tolerance: 1%  [RES_0805]  (hidden comment: RC0805FR-071ML)
R70  value 100K  Power: .25W  Tolerance: 1%  [RES_0805]  (hidden comment: RC0805FR-07100KL)
R71  value 255K  Power: .125W  Tolerance: 1%  [RES_0805]  (hidden comment: RC0805FR-07255KL)
R72  value 0  Power: .25W  [RES_0805]  (hidden comment: RC0805JR-070RL)
TP16  S1751-46R  [HARWIN_S1751]
TP17  S1751-46R  [HARWIN_S1751]
U13  value 3.5V-36V  [SOP65P640X120-17N]  (hidden comment: LM43601PWPR)

### Ports
PE_OD (in)

### Nets
GND: C43.2 C44.1 C45.1 C46.1 L2.2 MTN1.1 MTN2.1 MTN3.1 MTN4.1 R67.2 R68.1 R69.2 TP17.1 U13.5(BIAS)
VBAT: C43.1 C47.1 Q4.2(S) R70.2 U13.13(VIN) U13.14(VIN)
VEE: J12.2 R72.2
NetC42_1: C42.1 U13.3(CBOOT)
NetC42_2: C42.2 L2.1 U13.1(SW) U13.2(SW)
NetC44_2: C44.2 R69.1 R71.2 U13.9(FB)
NetC45_2: C45.2 C46.2 C47.2 C48.2 J12.1 R71.1 R72.1 TP16.1 U13.10(AGND) U13.15(PGND) U13.16(PGND) U13.17(PAD)
NetC48_1: C48.1 U13.4(VCC)
NetQ2_1: Q4.1(G) R70.1 ; port PE_OD
NetQ4_3: Q4.3(D) R68.2 U13.12(EN)
NetR67_1: R67.1 U13.8(PGOOD)

Not connected (* = marked no-connect by the designer): U13 6(SYNC) 7(RT) 11(SS/TRK)

### Notes on the sheet
- MOUNTING HARDWARE
- MOUNTING HOLES
- VBAT MIN FOR THIS -5V RAIL TO 3.5V
- NOTES:
- VEE RAIL -5.0V @ 200MA
- VEE TURNS ON WITH VALID VCC
- Title
- Size:
- Date:
- B
- Number:
- Time:
- Revision:
- Sheet
- of
- IMR Engineering
- Engineer:
- File:

### Library data of the parts
C42 = CAP_SMD_470NF_50V_0805: CAP CER 0.47UF 6.3V X5R 0402; MFG: Murata Electronics; Case/Package: 0805; MFG_PN: GRM155R60J474KE19D; Supplier 1: DigiKey; Supplier Part Number 1: 490-3266-1-ND; Unit Price: .10
C43 C46 = CAP_SMD_47UF_16V_1210: as C1 on sheet SoftCore_SA_P2; Case/Package: 1210; MFG_PN: GRM32ER60J476ME20L; Supplier 1: DigiKey; Supplier Part Number 1: 490-1887-1-ND; Unit Price: .28
C44 = CAP_SMD_27PF_50V_0805: CAP CER 27PF 50V C0G/NP0 0805; MFG: KEMET; Case/Package: 0805; MFG_PN: C0805C270J5GACTU; Supplier 1: DigiKey; Supplier Part Number 1: 399-C0805C270J5GACTUCT-ND; Unit Price: .11
C45 C47 = CAP_SMD_4.7UF_50V_0805: as C34 on sheet SoftCore_SA_P6; Case/Package: 0805; MFG_PN: GRM21BR61H475KE51L; Supplier 1: DigiKey; Supplier Part Number 1: 490-10751-1-ND; Unit Price: .19
C48 = CAP_SMD_2.2UF_50V_0805: CAP CER 2.2UF 50V X5R 0805; MFG: Murata Electronics; Case/Package: 0805; MFG_PN: GRM219R61E225KA12J; Supplier 1: DigiKey; Supplier Part Number 1: 490-GRM219R61E225KA12JCT-ND; Unit Price: .38
J12 = CONN_JUMPER_2P_100MIL_VERT: as J9 on sheet SoftCore_SA_P6; Case/Package: 2P_2.54MM; MFG_PN: PREC002SFAN-RC; Supplier 1: Digi-Key; Supplier Part Number 1: S1212EC-02-ND; Value: *; Unit Price: .07
L2 = INDUCTOR_VLS3012ET-150M: FIXED IND 15UH 550MA 516MOHM SMD; MFG: TDK Corporation; Tolerance: 20%; Case/Package: SRN4018TA; Supplier 1: DigiKey; Supplier Part Number 1: 445-6660-1-ND; Unit Price: .26; MFG_PN: VLS3012ET-150M
MECH1-MECH4 = MECHANICAL_SCREW_M3X6_PAN_HEAD: SCREW M3X6 PAN HEAD SS; MFG: APM Hexseal; Case/Package: SCREW_M3X6; Supplier 1: DigiKey; Supplier Part Number 1: 335-1156-ND; Unit Price: .58; MFG_PN: RM3X6MM 2701
MECH5-MECH8 = MECHANICAL_STANDOFF_M3X20: HEX STANDOFF M3 BRASS 20MM; MFG: Keystone Electronics; Case/Package: STANDOFF_M3X20; Supplier 1: DigiKey; Supplier Part Number 1: 36-24407-ND; Unit Price: 1.36; MFG_PN: 24407
MECH9 = MECHANICAL_SPEAKER_MOUNTED: SPEAKER PANEL MOUNT; MFG: ARDUINO; Case/Package: 312815-3W_PCB; Supplier 1: ARDUINO; Supplier Part Number 1: 312815-3W; Unit Price: 2.50; MFG_PN: 312815-3W
MECH10 = MODULE_ARTY_A7: DEVELOPMENT BOARD FPGA XILINX A7; MFG: Digilent, Inc.; Case/Package: NA; Supplier 1: DigiKey; Supplier Part Number 1: 1286-1206-ND; Unit Price: 299.00; MFG_PN: 410-319-1
MTN1-MTN4 = MTN_HOLE_3.3MM: MOUNTING HOLE 3.3MM
Q4 = MOSFET_PCH_IRLML5103TRPBF: as Q2 on sheet SoftCore_SA_P6; Case/Package: 8-PowerTDFN; Supplier 1: DigiKey; Supplier Part Number 1: IRLML5103PBFCT-ND; Unit Price: .45; MFG_PN: IRLML5103TRPBF
R67 R68 R70 = RES_SMD_100K_0805_1/4W_1%: as R55 on sheet SoftCore_SA_P6; Case/Package: 0805; MFG_PN: RC0805FR-07100KL; Supplier 1: DigiKey; Supplier Part Number 1: 311-100KCRCT-ND; Unit Price: .13
R69 = RES_SMD_1M_0805_1/8W_1%: RES SMD 1M OHM 1% 1/8W 0805; MFG: Yageo; Case/Package: 0805; MFG_PN: RC0805FR-071ML; Supplier 1: DigiKey; Supplier Part Number 1: 311-1.00MCRCT-ND; Unit Price: .12
R71 = RES_SMD_255K_0805_1/8W_1%: RES SMD 255K OHM 1% 1/8W 0805; MFG: Yageo; Case/Package: 0805; MFG_PN: RC0805FR-07255KL; Supplier 1: DigiKey; Supplier Part Number 1: 311-255KCRCT-ND; Unit Price: .10
R72 = RES_SMD_0_0805_1/8W_1%: RES SMD 0 OHM 1% 1/8W 0805; MFG: Yageo; Case/Package: 0805; MFG_PN: RC0805JR-070RL; Supplier 1: DigiKey; Supplier Part Number 1: 311-0.0ARCT-ND; Unit Price: .1; Tolerance: 1%
TP16 TP17 = CONN_TEST_POINT_S1751-46R: PCB TEST POINT CONNECT; MFG: Harwin Inc; Case/Package: S1751; Supplier 1: Digi-Key; Supplier Part Number 1: 952-1478-1-ND; Value: *; Unit Price: .28; MFG_PN: S1751-46R
U13 = IC_SMPS_LM43601PWPR: IC REG BUCK ADJ 1A 16HTSSOP; MFG: Texas Instruments; Case/Package: 16HTSSOP; Supplier 1: DigiKey; Supplier Part Number 1: 296-40221-1-ND; Unit Price: 4.41; Current: 1A; MFG_PN: LM43601PWPR

## Nets that join several sheets
3V3: SoftCore_SA_P2 (13 pins), SoftCore_SA_P3 (16 pins), SoftCore_SA_P4 (9 pins), SoftCore_SA_P5 (C17.1 R48.2 U10.8)
GND: SoftCore_SA_P2 (23 pins), SoftCore_SA_P3 (15 pins), SoftCore_SA_P4 (16 pins), SoftCore_SA_P5 (18 pins), SoftCore_SA_P6 (23 pins), SoftCore_SA_P7 (14 pins)
VBAT: SoftCore_SA_P6 (9 pins), SoftCore_SA_P7 (6 pins)
VCC: SoftCore_SA_P4 (D3.2 REL1.2), SoftCore_SA_P5 (6 pins), SoftCore_SA_P6 (J10.1 Q3.1 R62.1 R66.2)
VCELL: SoftCore_SA_P4 (R28.2), SoftCore_SA_P6 (Q2.3)
VEE: SoftCore_SA_P5 (C26.2 C27.2 U7.4 U8.4), SoftCore_SA_P7 (J12.2 R72.2)
A_SIG: SoftCore_SA_P3 (J3.10), SoftCore_SA_P5 (C49.2 TP12.1)
NetC14_2: SoftCore_SA_P4 (REL1.1), SoftCore_SA_P5 (C14.2 R32.2 U8.1)
NetJ6_7: SoftCore_SA_P4 (J6.7), SoftCore_SA_P5 (U9.1)
NetQ2_1: SoftCore_SA_P6 (Q2.1 Q3.3 R63.1), SoftCore_SA_P7 (Q4.1 R70.1)